# Altium project standos.PrjPcb
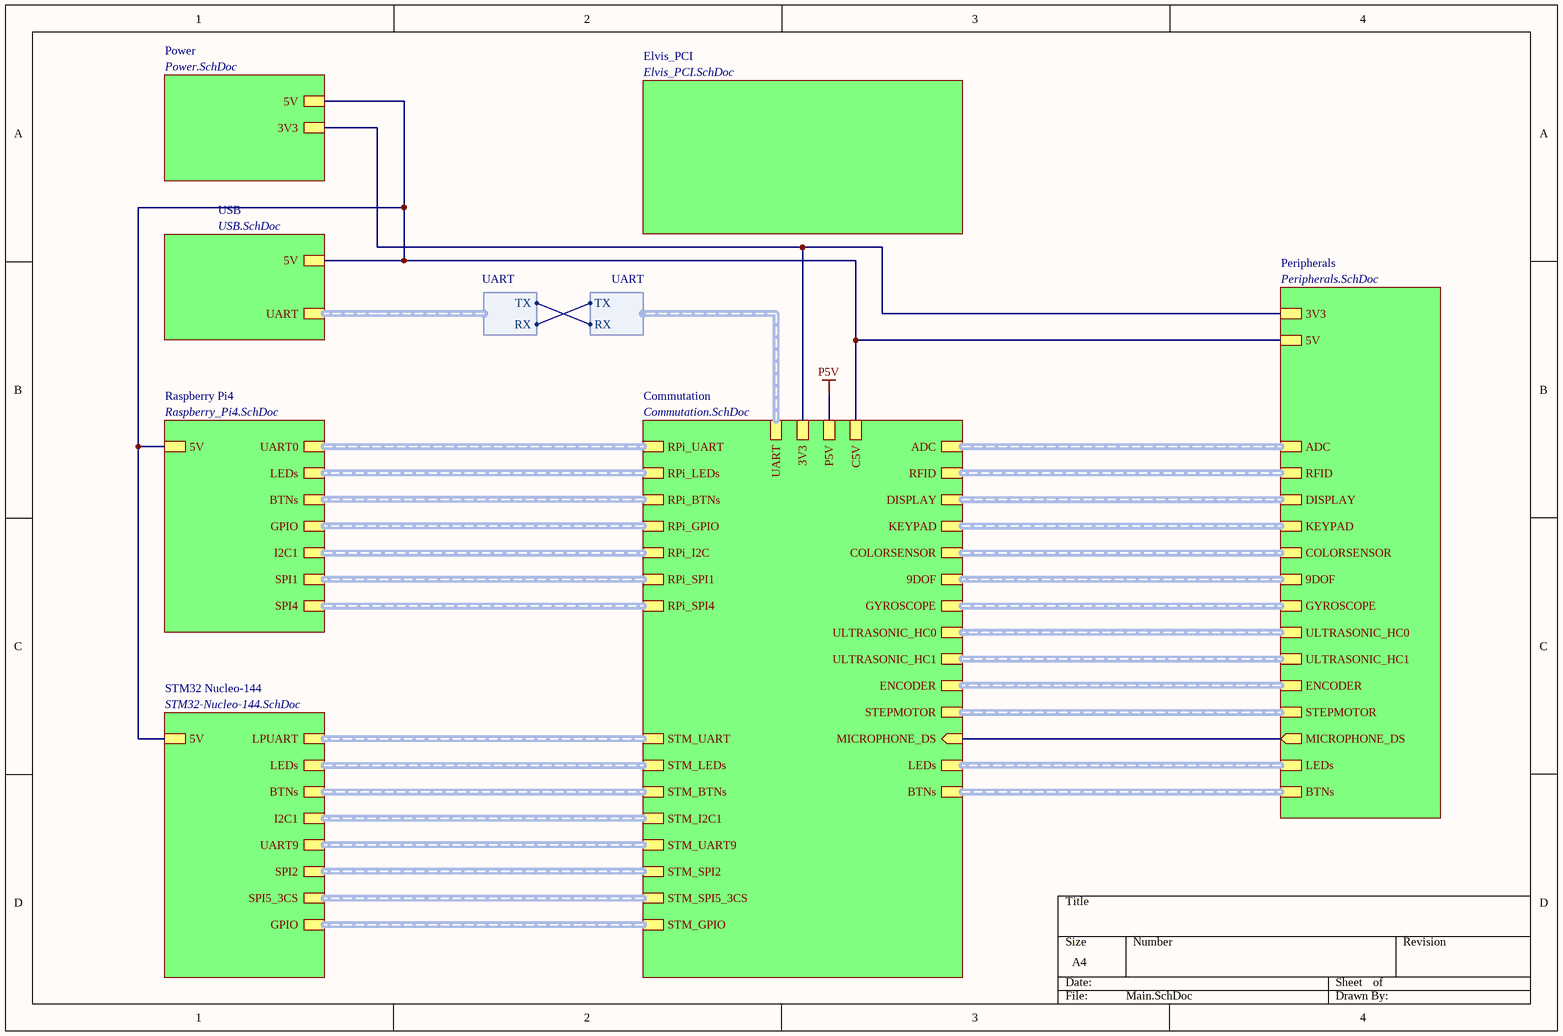
[diagram p0: Main.SchDoc]
11 sheets, 106 parts. Net scope: hierarchical (ports join the sheet entries above them; power ports are global).
Board files: standos.PcbDoc, standos_RPi_view.PcbDoc
Sheets:
  Main.SchDoc
    Power = Power.SchDoc
    Raspberry Pi4 = Raspberry_Pi4.SchDoc
    Elvis_PCI = Elvis_PCI.SchDoc
    Commutation = Commutation.SchDoc
    USB = USB.SchDoc
    Peripherals = Peripherals.SchDoc
      Inertial systems = Inertial_systems.SchDoc
      Rangefinders = Rangefinders.SchDoc
      Display = Display.SchDoc
    STM32 Nucleo-144 = STM32-Nucleo-144.SchDoc

## Sheet Main.SchDoc
size A4; SheetNumber: 1; SheetTotal: 11

### Sub-sheets
Commutation = Commutation.SchDoc: RPi_I2C (harness I2C), GYROSCOPE (harness GY-50 L3GD20 Gyro), STEPMOTOR (harness ULN2003 Module), DISPLAY (harness MSP3520), UART (harness UART), RPi_UART (harness UART), STM_UART (harness UART), MICROPHONE_DS (in), RPi_BTNs (harness BUTTONS), STM_BTNs (harness BUTTONS), BTNs (harness BUTTONS), RPi_LEDs (harness LEDS), LEDs (harness LEDS), STM_LEDs (harness LEDS), RPi_SPI4 (harness SPI_2CS), RPi_GPIO (harness RPi_GPIO), ADC (harness ADS1115 module), ULTRASONIC_HC0 (harness HC-SR04), ULTRASONIC_HC1 (harness HC-SR04), KEYPAD (harness Keypad COM-08653), RPi_SPI1 (harness SPI_3CS), RFID (harness RC522), STM_UART9 (harness UART), STM_SPI5_3CS (harness SPI_3CS), STM_I2C1 (harness I2C), STM_SPI2 (harness SPI), STM_GPIO (harness STM32_GPIO), 3V3, P5V, C5V, 9DOF (harness 9DOF), COLORSENSOR (harness TCS34725), ENCODER (harness KY-040)
Elvis_PCI = Elvis_PCI.SchDoc: no entries
Peripherals = Peripherals.SchDoc: 3V3, RFID (harness RC522), 5V, STEPMOTOR (harness ULN2003 Module), GYROSCOPE (harness GY-50 L3GD20 Gyro), MICROPHONE_DS (out), DISPLAY (harness MSP3520), BTNs (harness BUTTONS), ADC (harness ADS1115 module), LEDs (harness LEDS), ULTRASONIC_HC1 (harness HC-SR04), ULTRASONIC_HC0 (harness HC-SR04), KEYPAD (harness Keypad COM-08653), 9DOF (harness 9DOF), COLORSENSOR (harness TCS34725), ENCODER (harness KY-040)
Power = Power.SchDoc: 3V3, 5V
Raspberry Pi4 = Raspberry_Pi4.SchDoc: I2C1 (harness I2C), UART0 (harness UART), BTNs (harness BUTTONS), LEDs (harness LEDS), SPI4 (harness SPI_2CS), GPIO (harness RPI_GPIO), 5V, SPI1 (harness SPI_3CS)
STM32 Nucleo-144 = STM32-Nucleo-144.SchDoc: LEDs (harness LEDS), LPUART (harness UART), BTNs (harness BUTTONS), UART9 (harness UART), SPI2 (harness SPI), I2C1 (harness I2C), SPI5_3CS (harness SPI_3CS), GPIO (harness STM32_GPIO), 5V
USB = USB.SchDoc: UART (harness UART), 5V

### Harnesses
UART: TX, RX

### Nets
3V3: sheet Power/3V3, sheet Commutation/3V3, sheet Peripherals/3V3
C5V: sheet Power/5V, sheet Raspberry Pi4/5V, sheet Commutation/C5V, sheet USB/5V, sheet Peripherals/5V, sheet STM32 Nucleo-144/5V
MICROPHONE_DS: sheet Commutation/MICROPHONE_DS, sheet Peripherals/MICROPHONE_DS
RPi_GPIO14: sheet USB/UART.RX, sheet Raspberry Pi4/UART0.TX
RPi_GPIO15: sheet USB/UART.TX, sheet Raspberry Pi4/UART0.RX

### Buses and harness runs
harness sheet Commutation/9DOF = sheet Peripherals/9DOF
harness sheet Commutation/ADC = sheet Peripherals/ADC
harness sheet Commutation/BTNs = sheet Peripherals/BTNs
harness sheet Commutation/COLORSENSOR = sheet Peripherals/COLORSENSOR
harness sheet Commutation/DISPLAY = sheet Peripherals/DISPLAY
harness sheet Commutation/ENCODER = sheet Peripherals/ENCODER
harness sheet Commutation/GYROSCOPE = sheet Peripherals/GYROSCOPE
harness sheet Commutation/KEYPAD = sheet Peripherals/KEYPAD
harness sheet Commutation/LEDs = sheet Peripherals/LEDs
harness sheet Commutation/RFID = sheet Peripherals/RFID
harness sheet Commutation/RPi_BTNs = sheet Raspberry Pi4/BTNs
harness sheet Commutation/RPi_GPIO = sheet Raspberry Pi4/GPIO
harness sheet Commutation/RPi_I2C = sheet Raspberry Pi4/I2C1
harness sheet Commutation/RPi_LEDs = sheet Raspberry Pi4/LEDs
harness sheet Commutation/RPi_SPI1 = sheet Raspberry Pi4/SPI1
harness sheet Commutation/RPi_SPI4 = sheet Raspberry Pi4/SPI4
harness sheet Commutation/RPi_UART = sheet Raspberry Pi4/UART0
harness sheet Commutation/STEPMOTOR = sheet Peripherals/STEPMOTOR
harness sheet Commutation/STM_BTNs = sheet STM32 Nucleo-144/BTNs
harness sheet Commutation/STM_GPIO = sheet STM32 Nucleo-144/GPIO
harness sheet Commutation/STM_I2C1 = sheet STM32 Nucleo-144/I2C1
harness sheet Commutation/STM_LEDs = sheet STM32 Nucleo-144/LEDs
harness sheet Commutation/STM_SPI2 = sheet STM32 Nucleo-144/SPI2
harness sheet Commutation/STM_SPI5_3CS = sheet STM32 Nucleo-144/SPI5_3CS
harness sheet Commutation/STM_UART9 = sheet STM32 Nucleo-144/UART9
harness sheet Commutation/STM_UART = sheet STM32 Nucleo-144/LPUART
harness sheet Commutation/ULTRASONIC_HC0 = sheet Peripherals/ULTRASONIC_HC0
harness sheet Commutation/ULTRASONIC_HC1 = sheet Peripherals/ULTRASONIC_HC1

## Sheet Power.SchDoc
size A4; SheetNumber: 4; SheetTotal: 11
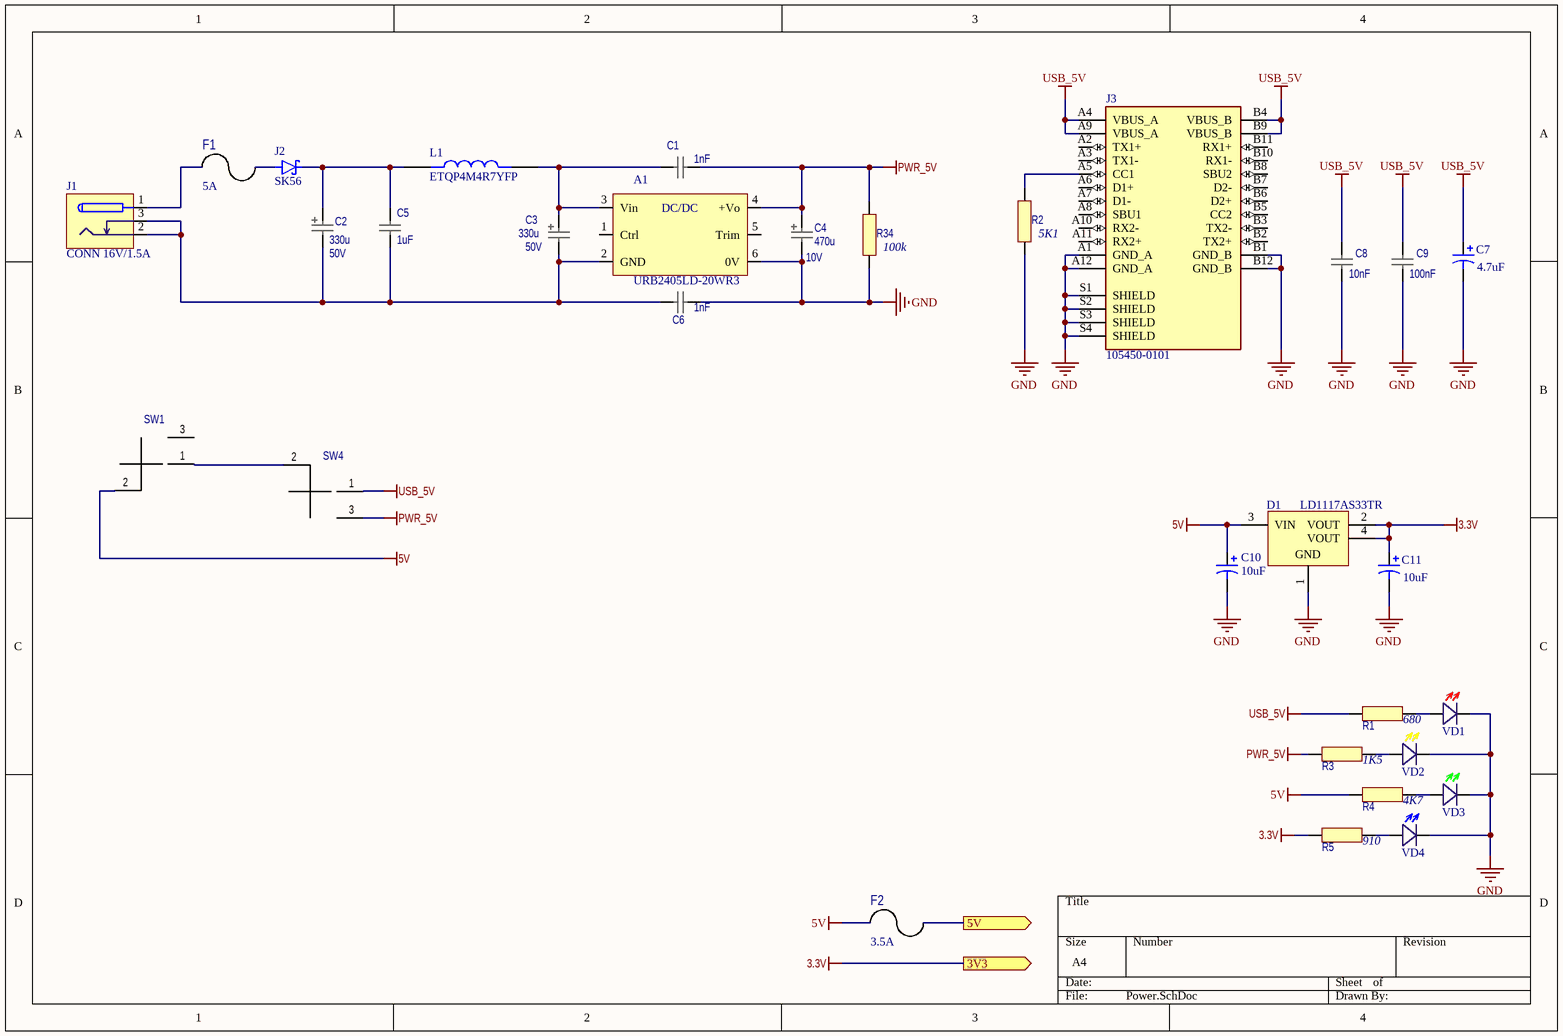
[diagram p1: Power.SchDoc]

### Parts
A1  URB2405LD-20WR3  [URB2405LD-20WR3]
C1  value 1nF  [C0805]  (hidden comment: C0805)
C2  value 330u  Voltage: 50V  [ECAP_10x17]  (hidden comment: C+)
C3  value 330u  Voltage: 50V  [ECAP_10x17]  (hidden comment: C+)
C4  value 470u  Voltage: 10V  [ECAP_8x12]  (hidden comment: C+)
C5  value 1uF  [C0805]  (hidden comment: C0805)
C6  value 1nF  [C0805]  (hidden comment: C0805)
C7  value 4.7uF  [D]  (hidden comment: 194D475X0015D2)
C8  value 10nF  [C0805]  (hidden comment: C0805)
C9  value 100nF  [C0805]  (hidden comment: C0805)
C10  value 10uF  [E]  (hidden comment: 194D106X0015E2)
C11  value 10uF  [3216]  (hidden comment: 293D106X0004A2)
D1  LD1117AS33TR  [SOT-223_N]
F1  5A  [FUSC6127X269N]
F2  3.5A  [FUSC6127X269N]
J1  CONN 16V/1.5A  [DS-261]
J2  SK56  [SMC]
J3  105450-0101  [MOLEX_105450-0101]
L1  ETQP4M4R7YFP  [L]
R1  value 680  [R0805]  (hidden comment: R0805)
R2  value 5K1  [R0805]  (hidden comment: R0805)
R3  value 1K5  [R0805]  (hidden comment: R0805)
R4  value 4K7  [R0805]  (hidden comment: R0805)
R5  value 910  [R0805]  (hidden comment: R0805)
R34  value 100k  [R0805]  (hidden comment: R0805)
SW1  KLS7-SS03-12D02-EG-3.0  [SL19123]  (value not drawn)
SW4  KLS7-SS03-12D02-EG-3.0  [switch]  (value not drawn)
VD1  TO-1608BC-MRE  [TO-1608BC-MRE]  (value not drawn)
VD2  TO-1608BC-MYF  [TO-1608BC-MYF]  (value not drawn)
VD3  TO-1608BC-PG  [TO-1608BC-PG]  (value not drawn)
VD4  TO-1608BC-BF  [TO-1608BC-BF]  (value not drawn)

### Ports
3V3 (out), 5V (out)

### Nets
3.3V: C11.1 D1.2(VOUT) D1.4(VOUT) R5.2 ; port 3V3  [project net 3V3]
5V: C10.1 D1.3(VIN) F2.1 R4.2 SW1.2
GND: A1.6(0V) C4.2 C6.1 C7.2 C8.1 C9.1 C10.2 C11.2 D1.1(GND) J3.A1(GND_A) J3.A12(GND_A) J3.B1(GND_B) J3.B12(GND_B) J3.S1(SHIELD) J3.S2(SHIELD) J3.S3(SHIELD) J3.S4(SHIELD) R2.2 R34.2 VD1.- VD2.- VD3.- VD4.-
PWR_5V: A1.4(+Vo) C1.1 C4.1 R3.2 R34.1 SW4.3
USB_5V: C7.1 C8.2 C9.2 F2.2 J3.A4(VBUS_A) J3.A9(VBUS_A) J3.B4(VBUS_B) J3.B9(VBUS_B) R1.2 SW4.1 ; port 5V  [project net C5V]
NetA1_2: A1.2(GND) C2.2 C3.2 C5.1 C6.2 J1.2 J1.3
NetA1_3: A1.3(Vin) C1.2 C3.1 L1.2
NetC2_1: C2.1 C5.2 J2.2(C) L1.1
NetF1_1: F1.1 J1.1
NetF1_2: F1.2 J2.1(A)
NetJ3_A5: J3.A5(CC1) R2.1
NetR1_1: R1.1 VD1.+
NetR3_1: R3.1 VD2.+
NetR4_1: R4.1 VD3.+
NetR5_1: R5.1 VD4.+
NetSW1_1: SW1.1 SW4.2

Not connected (* = marked no-connect by the designer): A1 1(Ctrl) 5(Trim); J3 A2(TX1+) A3(TX1-) A6(D1+) A7(D1-) A8(SBU1) A10(RX2-) A11(RX2+) B2(TX2+) B3(TX2-) B5(CC2) B6(D2+) B7(D2-) B8(SBU2) B10(RX1-) B11(RX1+); SW1 3

### Notes on the sheet
- (in symbol URB2405LD-20WR3) DC/DC

### Library data of the parts
C1 C5 C6 C8 C9 = C0805: Tolerance: %; Voltage: B; Case: *; Dielectric: *; Mount: *; PartNumber: *
C2-C4 = C+: Tolerance: %; Case: *; Dielectric: *; Mount: *; PartNumber: *
C7 = 194D475X0015D2: Midget Conformal Coated Solid Tantalum Chip Capacitor: 4.7uF, 20% Tolerance, 15 WVDC @ +85°C, Surge = 20V; Note: See Data Sheet for full range of components; Published: 19-Mar-2004; PackageReference: D; Publisher: Altium Limited; DatasheetDocument: 05-Jul-2002; ComponentLink1Description: Manufacturer Link; ComponentLink1URL: http://www.vishay.com/; ComponentLink2Description: Datasheet; ComponentLink2URL: http://www.vishay.com/docs/40000/194d.pdf
C10 = 194D106X0015E2: Midget Conformal Coated Solid Tantalum Chip Capacitor: 10uF, 20% Tolerance, 15 WVDC @ +85°C, Surge = 20V; Note: See Data Sheet for full range of components; Published: 19-Mar-2004; DatasheetDocument: 05-Jul-2002; PackageReference: E; Publisher: Altium Limited; ComponentLink1Description: Manufacturer Link; ComponentLink1URL: http://www.vishay.com/; ComponentLink2Description: Datasheet; ComponentLink2URL: http://www.vishay.com/docs/40000/194d.pdf
C11 = 293D106X0004A2: Tantamount Commercial, Surface Mount Solid Tantalum Chip Capacitor: 10uF, 20% Tolerance, 4 WVDC @ +85°C, Surge = 5.2V; Note: See Data Sheet for full range of components; Published: 19-Mar-2004; DatasheetDocument: 05-Feb-2003; PackageReference: 3216; Publisher: Altium Limited; Code_JEITA: 3216; ComponentLink1Description: Manufacturer Link; ComponentLink1URL: http://www.vishay.com/; ComponentLink2Description: Datasheet; ComponentLink2URL: http://www.vishay.com/docs/40002/293d.pdf
D1 = LD1117AS33TR: 1A, Low Drop Positive Voltage Regulator, 3.3V, 4-Pin SOT-223, Tape and Reel; PartNumber: LD1117AS33TR; DatasheetVersion: Dec-2011; PackageVersion: 2010; PackageReference: SOT-223; PackageDescription: 4-Pin SOT-223 Package, 6.5 x 3.5 mm Body, 2.3 mm Pitch, 7 mm Lead Span; ComponentLink1Description: Manufacturer URL; ComponentLink1URL: http://www.st.com; ComponentLink2Description: Datasheet; ComponentLink2URL: http://www.st.com/internet/com/TECHNICAL_RESOURCES/TECHNICAL_LITERATURE/DATASHEET/CD00002116.pdf
F1 F2 = F: 045303.5MR
J1 = DS-261
J2 = SK56: Diode Schottky 60V 5A Surface Mount SMC (DO-214AB); MF: Diotec Semiconductor; SnapEDA_Link: https://www.snapeda.com/parts/SK56/Diotec/view-part/5719358/?ref=snap; Package: DO-214AB-214 Diotec Semiconductor; Check_prices: https://www.snapeda.com/parts/SK56/Diotec/view-part/5719358/?ref=eda; Availability: In Stock; Price: None; MP: SK56; Value: *
L1 = ETQP4M4R7YFP: Power Choke Shielded Wirewound 4.7uH 20% 100KHz Metal 4.8A 39.6mOhm DCR Automotive T/R; MF: Panasonic; Value: *; Price: None; Package: SMD-2 Panasonic; Check_prices: https://www.snapeda.com/parts/ETQP4M4R7YFP/Panasonic/view-part/1533841/?ref=eda; Availability: In Stock; SnapEDA_Link: https://www.snapeda.com/parts/ETQP4M4R7YFP/Panasonic/view-part/1533841/?ref=snap; MP: ETQP4M4R7YFP; Purchase-URL: https://pricing.snapeda.com/search/part/ETQP4M4R7YFP/?ref=eda
SW1 = SL19123 (switch)
SW4 = SW
VD1 = TO-1608BC-MRE: LED SMD 1608 112мКд, 120°, 630нМ (Ultra Bright Red)
VD2 = TO-1608BC-MYF: LED SMD 1608 247мКд, 120°, 592нМ (High Bright Yellow)
VD3 = TO-1608BC-PG: LED SMD 1608 705мКд, 120°, 525нМ (Pure Green)
VD4 = TO-1608BC-BF: LED SMD 1608 247мКд, 120°, 468нМ (Blue)
J3 = 105450-0101: Package: None; Availability: Unavailable; Value: *; MP: 105450-0101; Price: None
R1-R5 R34 = R0805: Case: *; Mount: *; PartNumber: *; Power: *; Tolerance: *

## Sheet Raspberry_Pi4.SchDoc
size 381 x 241 mm; SheetNumber: 3; SheetTotal: 11
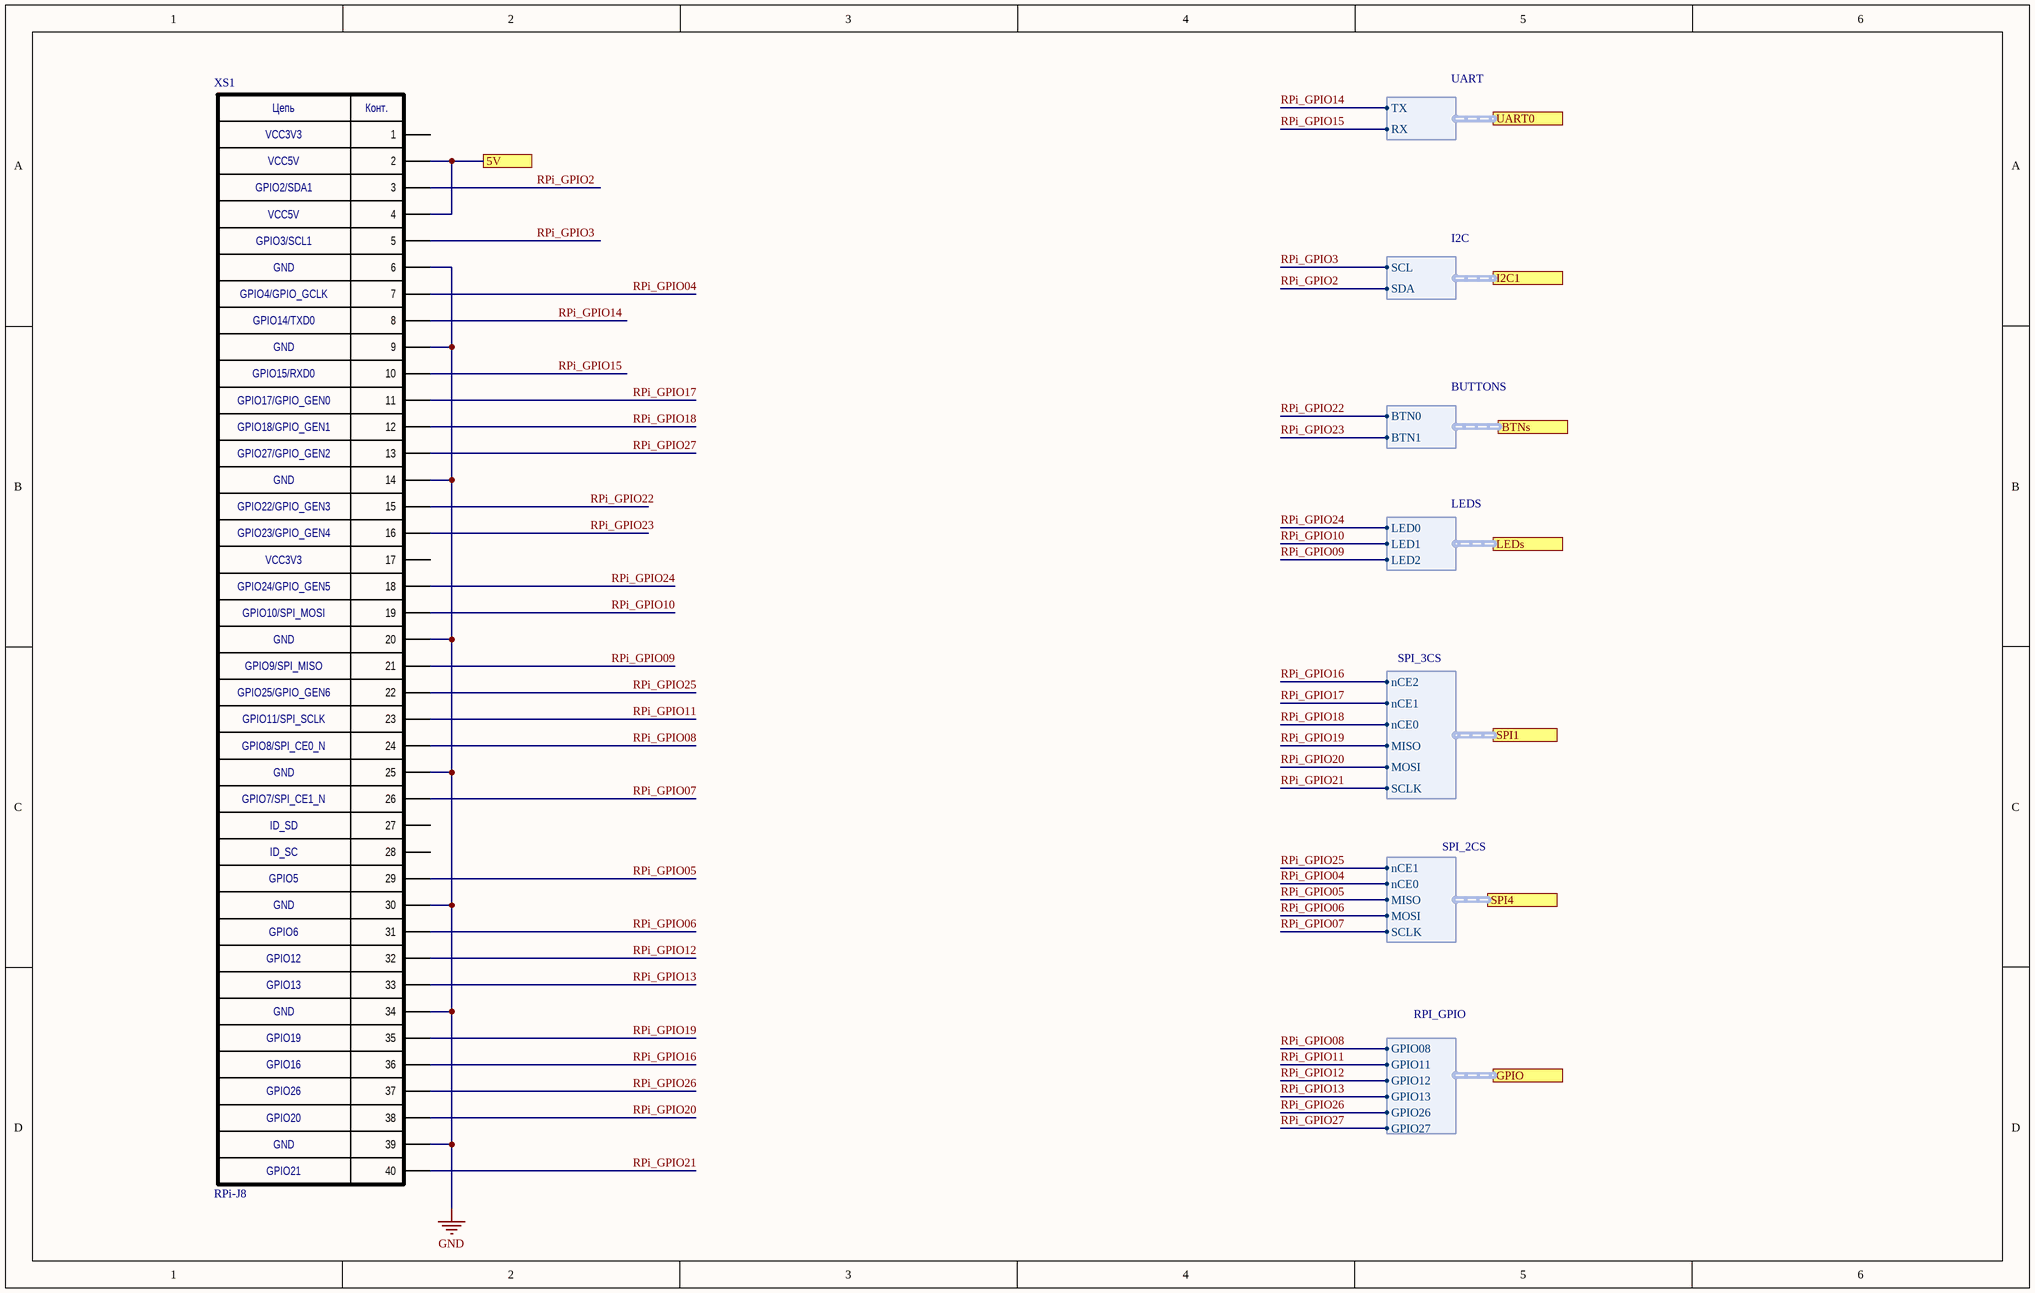
[diagram p2: Raspberry_Pi4.SchDoc]

### Parts
XS1  RPi-J8  40: GPIO21  39: GND  38: GPIO20  37: GPIO26  36: GPIO16  35: GPIO19  33: GPIO13  32: GPIO12  31: GPIO6  29: GPIO5  28: ID_SC  27: ID_SD  26: GPIO7/SPI_CE1_N  24: GPIO8/SPI_CE0_N  23: GPIO11/SPI_SCLK  22: GPIO25/GPIO_GEN6  21: GPIO9/SPI_MISO  19: GPIO10/SPI_MOSI  18: GPIO24/GPIO_GEN5  17: VCC3V3  16: GPIO23/GPIO_GEN4  15: GPIO22/GPIO_GEN3  13: GPIO27/GPIO_GEN2  8: GPIO14/TXD0  7: GPIO4/GPIO_GCLK  12: GPIO18/GPIO_GEN1  5: GPIO3/SCL1  4: VCC5V  3: GPIO2/SDA1  11: GPIO17/GPIO_GEN0  10: GPIO15/RXD0  [RaPi_PLD-40]

### Ports
5V, BTNs (harness BUTTONS), GPIO (harness RPI_GPIO), I2C1 (harness I2C), LEDs (harness LEDS), SPI1 (harness SPI_3CS), SPI4 (harness SPI_2CS), UART0 (harness UART)

### Harnesses
UART: TX, RX
I2C: SCL, SDA
RPI_GPIO: GPIO08, GPIO11, GPIO26, GPIO27, GPIO12, GPIO13
BUTTONS: BTN0, BTN1
LEDS: LED0, LED1, LED2
SPI_2CS: nCE1, nCE0, MISO, MOSI, SCLK
SPI_3CS: MISO, MOSI, nCE0, nCE1, nCE2, SCLK

### Nets
C5V: XS1.2 XS1.4 ; port 5V
GND: XS1.6 XS1.9 XS1.14 XS1.20 XS1.25 XS1.30 XS1.34 XS1.39
RPi_GPIO2: XS1.3 ; port I2C1.SDA  [project net 9DOF.I2C.SDA]
RPi_GPIO3: XS1.5 ; port I2C1.SCL  [project net 9DOF.I2C.SCL]
RPi_GPIO04: XS1.7 ; port SPI4.nCE0
RPi_GPIO05: XS1.29 ; port SPI4.MISO
RPi_GPIO06: XS1.31 ; port SPI4.MOSI
RPi_GPIO07: XS1.26 ; port SPI4.SCLK
RPi_GPIO08: XS1.24 ; port GPIO.GPIO08  [project net RPi_GPIO.GPIO08]
RPi_GPIO09: XS1.21 ; port LEDs.LED2  [project net LED2]
RPi_GPIO10: XS1.19 ; port LEDs.LED1  [project net LED1]
RPi_GPIO11: XS1.23 ; port GPIO.GPIO11  [project net RPi_GPIO.GPIO11]
RPi_GPIO12: XS1.32 ; port GPIO.GPIO12  [project net RPi_GPIO.GPIO12]
RPi_GPIO13: XS1.33 ; port GPIO.GPIO13  [project net RPi_GPIO.GPIO13]
RPi_GPIO14: XS1.8 ; port UART0.TX
RPi_GPIO15: XS1.10 ; port UART0.RX
RPi_GPIO16: XS1.36 ; port SPI1.nCE2
RPi_GPIO17: XS1.11 ; port SPI1.nCE1
RPi_GPIO18: XS1.12 ; port SPI1.nCE0
RPi_GPIO19: XS1.35 ; port SPI1.MISO
RPi_GPIO20: XS1.38 ; port SPI1.MOSI
RPi_GPIO21: XS1.40 ; port SPI1.SCLK
RPi_GPIO22: XS1.15 ; port BTNs.BTN0  [project net BTN0]
RPi_GPIO23: XS1.16 ; port BTNs.BTN1  [project net BTN1]
RPi_GPIO24: XS1.18 ; port LEDs.LED0  [project net LED0]
RPi_GPIO25: XS1.22 ; port SPI4.nCE1
RPi_GPIO26: XS1.37 ; port GPIO.GPIO26  [project net RPi_GPIO.GPIO26]
RPi_GPIO27: XS1.13 ; port GPIO.GPIO27  [project net RPi_GPIO.GPIO27]

Not connected (* = marked no-connect by the designer): XS1 1 17 27 28

### Notes on the sheet
- (in symbol RPi-J8) Цепь; Конт.

### Library data of the parts
XS1 = RPi-J8: 34: GND; 30: GND; 25: GND; 20: GND; 14: GND; 9: GND; 2: VCC5V; 6: GND; 1: VCC3V3

## Sheet Elvis_PCI.SchDoc
size A4; SheetNumber: 2; SheetTotal: 11
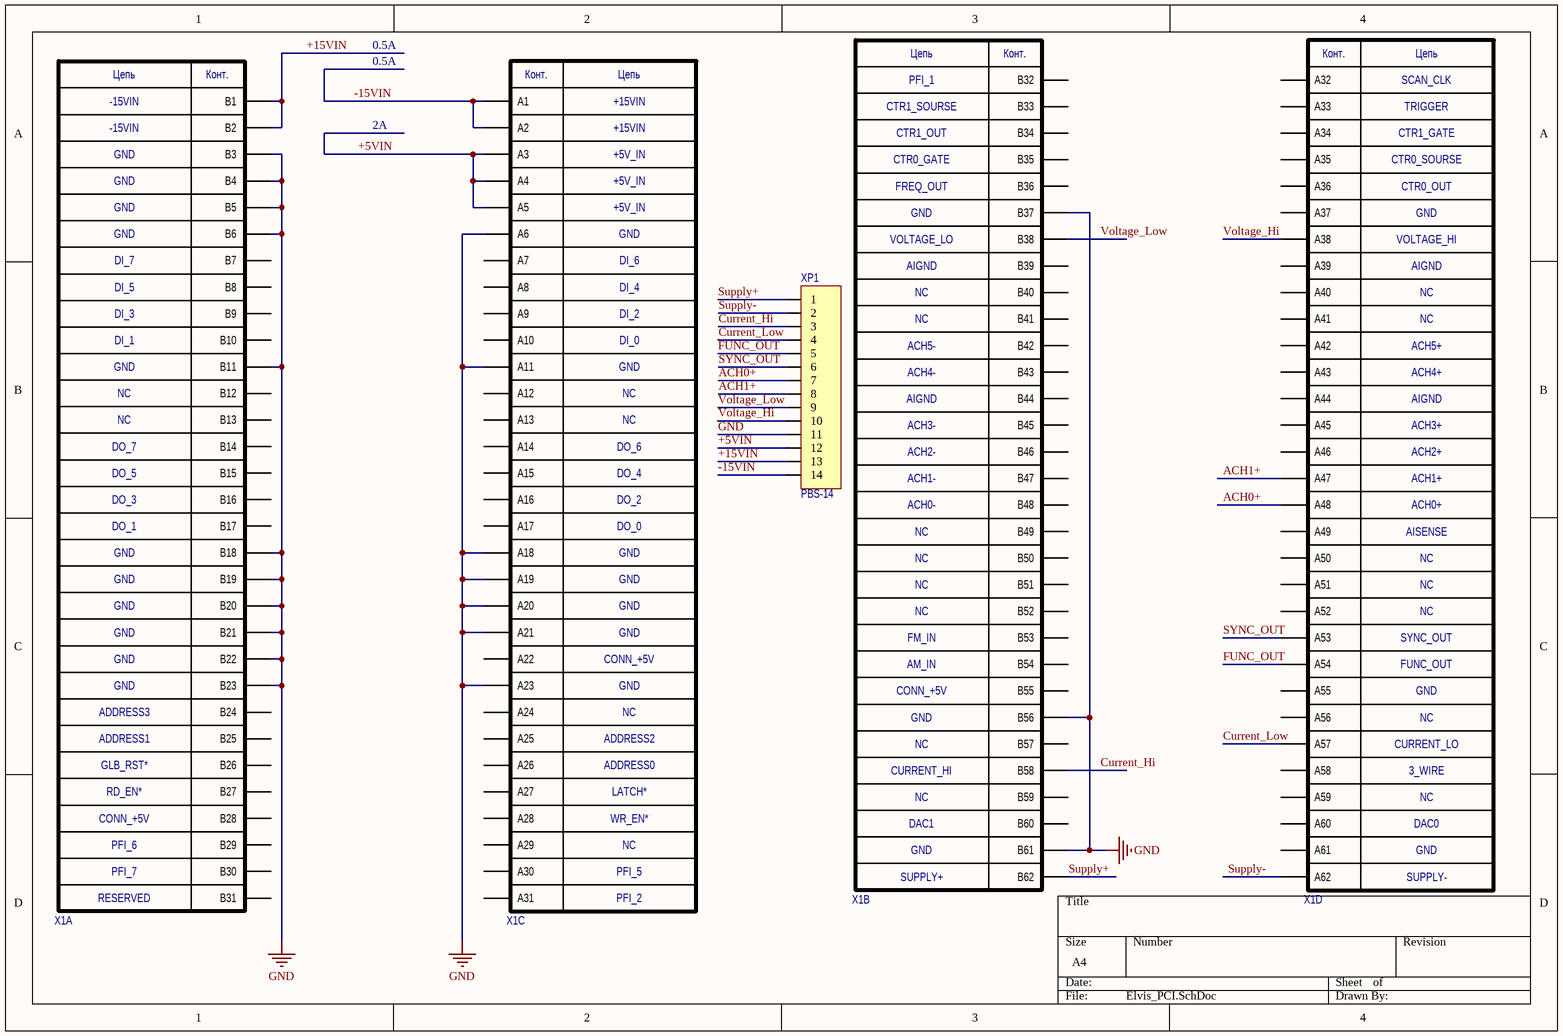
[diagram p3: Elvis_PCI.SchDoc]

### Parts
X1  PCI  [PCI]  (value not drawn)  (parts A,B,C,D of 4)
XP1  PBS-14  [PBS-14]

### Nets
GND: X1.A6 X1.A11 X1.A18 X1.A19 X1.A20 X1.A21 X1.A23 X1.B3 X1.B4 X1.B5 X1.B6 X1.B11 X1.B18 X1.B19 X1.B20 X1.B21 X1.B22 X1.B23 X1.B37 X1.B56 X1.B61 XP1.11
+5VIN: X1.A3 X1.A4 X1.A5 XP1.12
+15VIN: X1.B1 X1.B2 XP1.13
-15VIN: X1.A1 X1.A2 XP1.14
ACH0+: X1.A48 XP1.7
ACH1+: X1.A47 XP1.8
Current_Hi: X1.B58 XP1.3
Current_Low: X1.A57 XP1.4
FUNC_OUT: X1.A54 XP1.5
Supply+: X1.B62 XP1.1
Supply-: X1.A62 XP1.2
SYNC_OUT: X1.A53 XP1.6
Voltage_Hi: X1.A38 XP1.10
Voltage_Low: X1.B38 XP1.9

Not connected (* = marked no-connect by the designer): X1 A7 A8 A9 A10 A12 A13 A14 A15 A16 A17 A22 A24 A25 A26 A27 A28 A29 A30 A31 A32 A33 A34 A35 A36 A37 A39 A40 A41 A42 A43 A44 A45 A46 A49 A50 A51 A52 A55 A56 A58 A59 A60 A61 B7 B8 B9 B10 B12 B13 B14 B15 B16 B17 B24 B25 B26 B27 B28 B29 B30 B31 B32 B33 B34 B35 B36 B39 B40 B41 B42 B43 B44 B45 B46 B47 B48 B49 B50 B51 B52 B53 B54 B55 B57 B59 B60

### Notes on the sheet
- 0.5A
- 2A
- (in symbol PCI, part A) Цепь; Конт.; -15VIN; GND; DI_7; DI_5; DI_3; DI_1; NC; DO_7; DO_5; DO_3; DO_1; ADDRESS3; ADDRESS1; GLB_RST*; RD_EN*; CONN_+5V; PFI_6; PFI_7; RESERVED
- (in symbol PCI, part B) Цепь; Конт.; PFI_1; CTR1_SOURSE; CTR1_OUT; CTR0_GATE; FREQ_OUT; GND; VOLTAGE_LO; AIGND; NC; ACH5-; ACH4-; ACH3-; ACH2-; ACH1-; ACH0-; FM_IN; AM_IN; CONN_+5V; CURRENT_HI; DAC1; SUPPLY+
- (in symbol PCI, part C) Конт.; Цепь; +15VIN; +5V_IN; GND; DI_6; DI_4; DI_2; DI_0; NC; DO_6; DO_4; DO_2; DO_0; CONN_+5V; ADDRESS2; ADDRESS0; LATCH*; WR_EN*; PFI_5; PFI_2
- (in symbol PCI, part D) Конт.; Цепь; SCAN_CLK; TRIGGER; CTR1_GATE; CTR0_SOURSE; CTR0_OUT; GND; VOLTAGE_HI; AIGND; NC; ACH5+; ACH4+; ACH3+; ACH2+; ACH1+; ACH0+; AISENSE; SYNC_OUT; FUNC_OUT; CURRENT_LO; 3_WIRE; DAC0; SUPPLY-

## Sheet Commutation.SchDoc
size A3; SheetNumber: 5; SheetTotal: 11
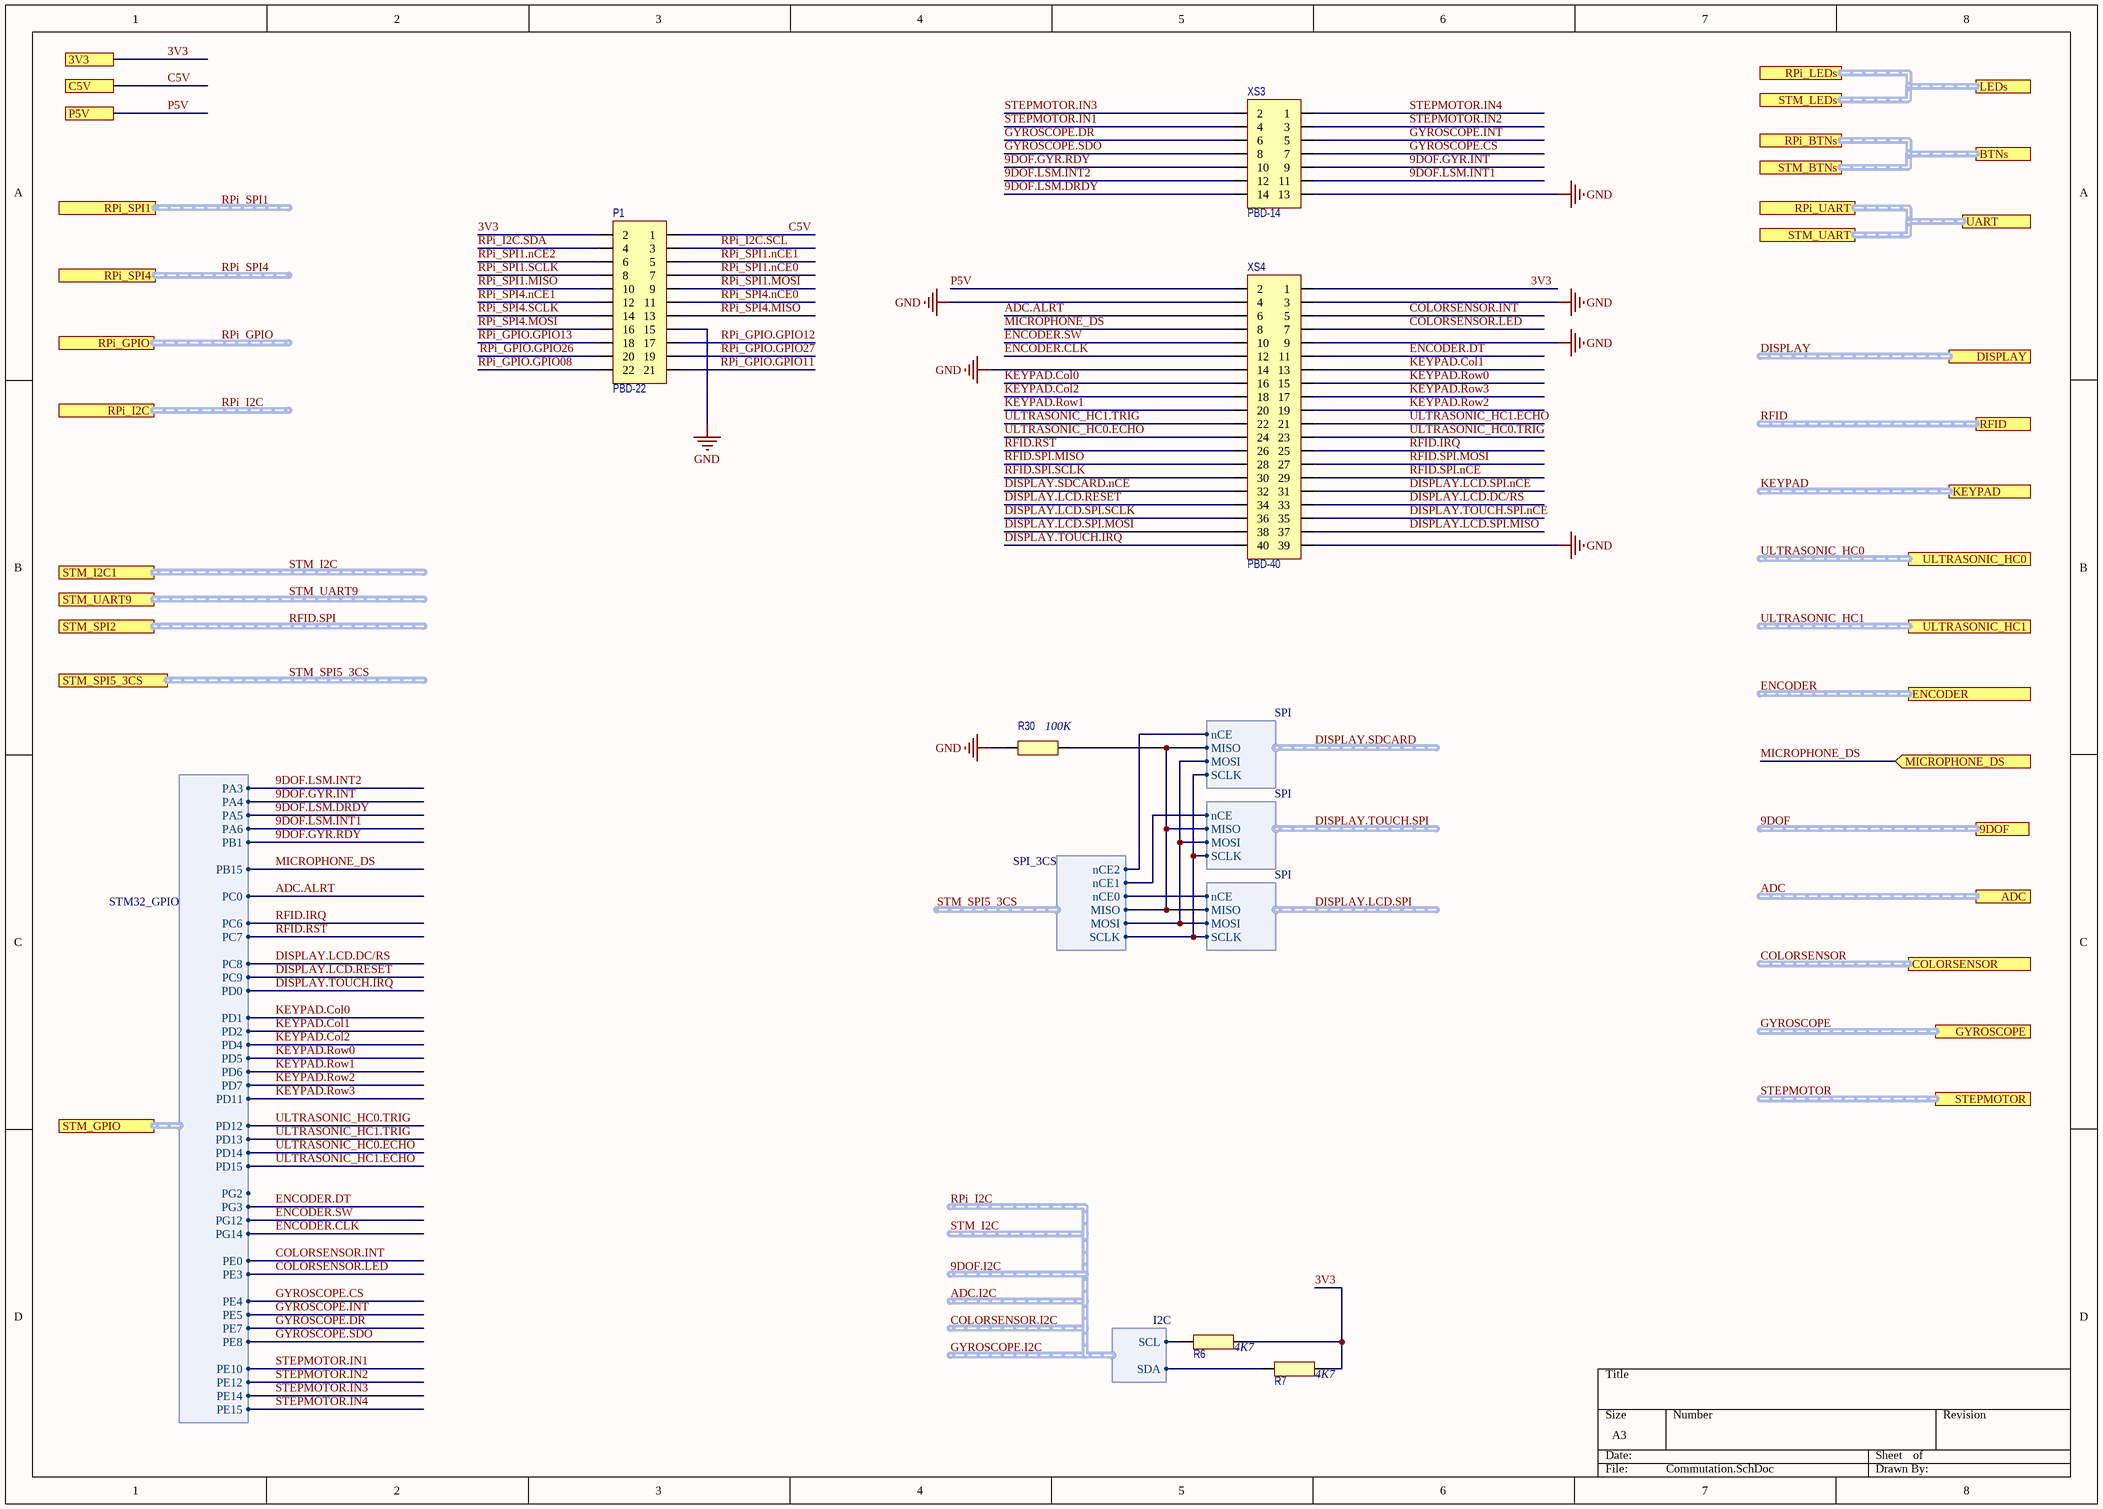
[diagram p4: Commutation.SchDoc]

### Parts
P1  PBD-22  [PBD-22]
R6  value 4K7  [R0805]  (hidden comment: R0805)
R7  value 4K7  [R0805]  (hidden comment: R0805)
R30  value 100K  [R0805]  (hidden comment: R0805)
XS3  PBD-14  [PBD-14]
XS4  PBD-40  [PBD-40]

### Ports
3V3, 9DOF (harness 9DOF), ADC (harness ADS1115 module), BTNs (harness BUTTONS), C5V, COLORSENSOR (harness TCS34725), DISPLAY (harness MSP3520), ENCODER (harness KY-040), GYROSCOPE (harness GY-50 L3GD20 Gyro), KEYPAD (harness Keypad COM-08653), LEDs (harness LEDS), MICROPHONE_DS (in), P5V, RFID (harness RC522), RPi_BTNs (harness BUTTONS), RPi_GPIO (harness RPi_GPIO), RPi_I2C (harness I2C), RPi_LEDs (harness LEDS), RPi_SPI1 (harness SPI_3CS), RPi_SPI4 (harness SPI_2CS), RPi_UART (harness UART), STEPMOTOR (harness ULN2003 Module), STM_BTNs (harness BUTTONS), STM_GPIO (harness STM32_GPIO), STM_I2C1 (harness I2C), STM_LEDs (harness LEDS), STM_SPI2 (harness SPI), STM_SPI5_3CS (harness SPI_3CS), STM_UART9 (harness UART), STM_UART (harness UART), UART (harness UART), ULTRASONIC_HC0 (harness HC-SR04), ULTRASONIC_HC1 (harness HC-SR04)

### Harnesses
I2C: SCL, SDA
SPI: nCE, MISO, MOSI, SCLK
STM32_GPIO: PB1, PB15, PC0, PC6, PC7, PC8, PC9, PD0, PD1, PD2, PD4, PD5, PD6, PD11, PD12, PD13, PD14, PD15, PG2, PG3, PG12, PG14, PE0, PE3, PE4, PE5, PE7, PE8, PE10, PE12, PE14, PE15, PD7, PA6, PA3, PA4, PA5
SPI_3CS: nCE2, nCE1, nCE0, MISO, MOSI, SCLK

### Nets
3V3: P1.2 R6.1 R7.1 XS4.1 ; port 3V3
C5V: P1.1 ; port C5V
GND: P1.15 R30.1 XS3.13 XS4.3 XS4.4 XS4.9 XS4.14 XS4.39
P5V: XS4.2 ; port P5V
9DOF.GYR.INT: XS3.9 ; port STM_GPIO.PA4
9DOF.GYR.RDY: XS3.10 ; port STM_GPIO.PB1
9DOF.I2C.SCL: R6.2 ; port RPi_I2C.SCL
9DOF.I2C.SDA: R7.2 ; port RPi_I2C.SDA
9DOF.LSM.DRDY: XS3.14 ; port STM_GPIO.PA5
9DOF.LSM.INT1: XS3.11 ; port STM_GPIO.PA6
9DOF.LSM.INT2: XS3.12 ; port STM_GPIO.PA3
ADC.ALRT: XS4.6 ; port STM_GPIO.PC0
COLORSENSOR.INT: XS4.5 ; port STM_GPIO.PE0
COLORSENSOR.LED: XS4.7 ; port STM_GPIO.PE3
DISPLAY.LCD.DC/RS: XS4.33 ; port STM_GPIO.PC8
DISPLAY.LCD.RESET: XS4.34 ; port STM_GPIO.PC9
DISPLAY.LCD.SPI.MISO: R30.2 ; harness SPI.MISO, port STM_SPI5_3CS.MISO
DISPLAY.LCD.SPI.MISO: XS4.37  [a separate net that carries the same name]
DISPLAY.LCD.SPI.MOSI: XS4.38
DISPLAY.LCD.SPI.MOSI: harness SPI.MOSI, port STM_SPI5_3CS.MOSI  [a separate net that carries the same name]
DISPLAY.LCD.SPI.nCE: XS4.31
DISPLAY.LCD.SPI.nCE: harness SPI.nCE, port STM_SPI5_3CS.nCE0  [a separate net that carries the same name]
DISPLAY.LCD.SPI.SCLK: XS4.36
DISPLAY.LCD.SPI.SCLK: harness SPI.SCLK, port STM_SPI5_3CS.SCLK  [a separate net that carries the same name]
DISPLAY.SDCARD.nCE: XS4.32
DISPLAY.SDCARD.nCE: harness SPI.nCE, port STM_SPI5_3CS.nCE2  [a separate net that carries the same name]
DISPLAY.TOUCH.IRQ: XS4.40 ; port STM_GPIO.PD0
DISPLAY.TOUCH.SPI.nCE: XS4.35
DISPLAY.TOUCH.SPI.nCE: harness SPI.nCE, port STM_SPI5_3CS.nCE1  [a separate net that carries the same name]
ENCODER.CLK: XS4.12 ; port STM_GPIO.PG14
ENCODER.DT: XS4.11 ; port STM_GPIO.PG3
ENCODER.SW: XS4.10 ; port STM_GPIO.PG12
GYROSCOPE.CS: XS3.7 ; port STM_GPIO.PE4
GYROSCOPE.DR: XS3.6 ; port STM_GPIO.PE7
GYROSCOPE.INT: XS3.5 ; port STM_GPIO.PE5
GYROSCOPE.SDO: XS3.8 ; port STM_GPIO.PE8
KEYPAD.Col0: XS4.16 ; port STM_GPIO.PD1
KEYPAD.Col1: XS4.13 ; port STM_GPIO.PD2
KEYPAD.Col2: XS4.18 ; port STM_GPIO.PD4
KEYPAD.Row0: XS4.15 ; port STM_GPIO.PD5
KEYPAD.Row1: XS4.20 ; port STM_GPIO.PD6
KEYPAD.Row2: XS4.19 ; port STM_GPIO.PD7
KEYPAD.Row3: XS4.17 ; port STM_GPIO.PD11
MICROPHONE_DS: XS4.8 ; port MICROPHONE_DS, port STM_GPIO.PB15
RFID.IRQ: XS4.25 ; port STM_GPIO.PC6
RFID.RST: XS4.26 ; port STM_GPIO.PC7
RFID.SPI.MISO: XS4.28
RFID.SPI.MOSI: XS4.27
RFID.SPI.nCE: XS4.29
RFID.SPI.SCLK: XS4.30
RPi_GPIO.GPIO08: P1.22
RPi_GPIO.GPIO11: P1.21
RPi_GPIO.GPIO12: P1.17
RPi_GPIO.GPIO13: P1.18
RPi_GPIO.GPIO26: P1.20
RPi_GPIO.GPIO27: P1.19
RPi_I2C.SCL: P1.3
RPi_I2C.SDA: P1.4
RPi_SPI1.MISO: P1.10
RPi_SPI1.MOSI: P1.9
RPi_SPI1.nCE0: P1.7
RPi_SPI1.nCE1: P1.5
RPi_SPI1.nCE2: P1.6
RPi_SPI1.SCLK: P1.8
RPi_SPI4.MISO: P1.13
RPi_SPI4.MOSI: P1.16
RPi_SPI4.nCE0: P1.11
RPi_SPI4.nCE1: P1.12
RPi_SPI4.SCLK: P1.14
STEPMOTOR.IN1: XS3.4 ; port STM_GPIO.PE10
STEPMOTOR.IN2: XS3.3 ; port STM_GPIO.PE12
STEPMOTOR.IN3: XS3.2 ; port STM_GPIO.PE14
STEPMOTOR.IN4: XS3.1 ; port STM_GPIO.PE15
ULTRASONIC_HC0.ECHO: XS4.24 ; port STM_GPIO.PD14  [project net STM_PD14]
ULTRASONIC_HC0.TRIG: XS4.23 ; port STM_GPIO.PD12  [project net STM_PD12]
ULTRASONIC_HC1.ECHO: XS4.21 ; port STM_GPIO.PD15  [project net STM_PD15]
ULTRASONIC_HC1.TRIG: XS4.22 ; port STM_GPIO.PD13  [project net STM_PD13]

### Buses and harness runs
harness 9DOF = port 9DOF
harness 9DOF.I2C = ADC.I2C = COLORSENSOR.I2C = GYROSCOPE.I2C = RPi_I2C = STM_I2C
harness ADC = port ADC
harness COLORSENSOR = port COLORSENSOR
harness DISPLAY = port DISPLAY
harness ENCODER = port ENCODER
harness GYROSCOPE = port GYROSCOPE
harness KEYPAD = port KEYPAD
harness port BTNs = port RPi_BTNs = port STM_BTNs
harness port LEDs = port RPi_LEDs = port STM_LEDs
harness port RPi_UART = port STM_UART = port UART
harness RFID = port RFID
harness RFID.SPI = port STM_SPI2
harness RPi_GPIO = port RPi_GPIO
harness RPi_I2C = port RPi_I2C
harness RPi_SPI1 = port RPi_SPI1
harness RPi_SPI4 = port RPi_SPI4
harness STEPMOTOR = port STEPMOTOR
harness STM_I2C = port STM_I2C1
harness STM_SPI5_3CS = port STM_SPI5_3CS
harness STM_UART9 = port STM_UART9
harness ULTRASONIC_HC0 = port ULTRASONIC_HC0
harness ULTRASONIC_HC1 = port ULTRASONIC_HC1

### Library data of the parts
R6 R7 R30 = R0805: Case: *; Mount: *; PartNumber: *; Power: *; Tolerance: *

## Sheet USB.SchDoc
size A4; SheetNumber: 6; SheetTotal: 11; SPICEModelCacheVCEAXSSD: <root> / <DocumentId>VCEAXSSD</DocumentId> / </root>
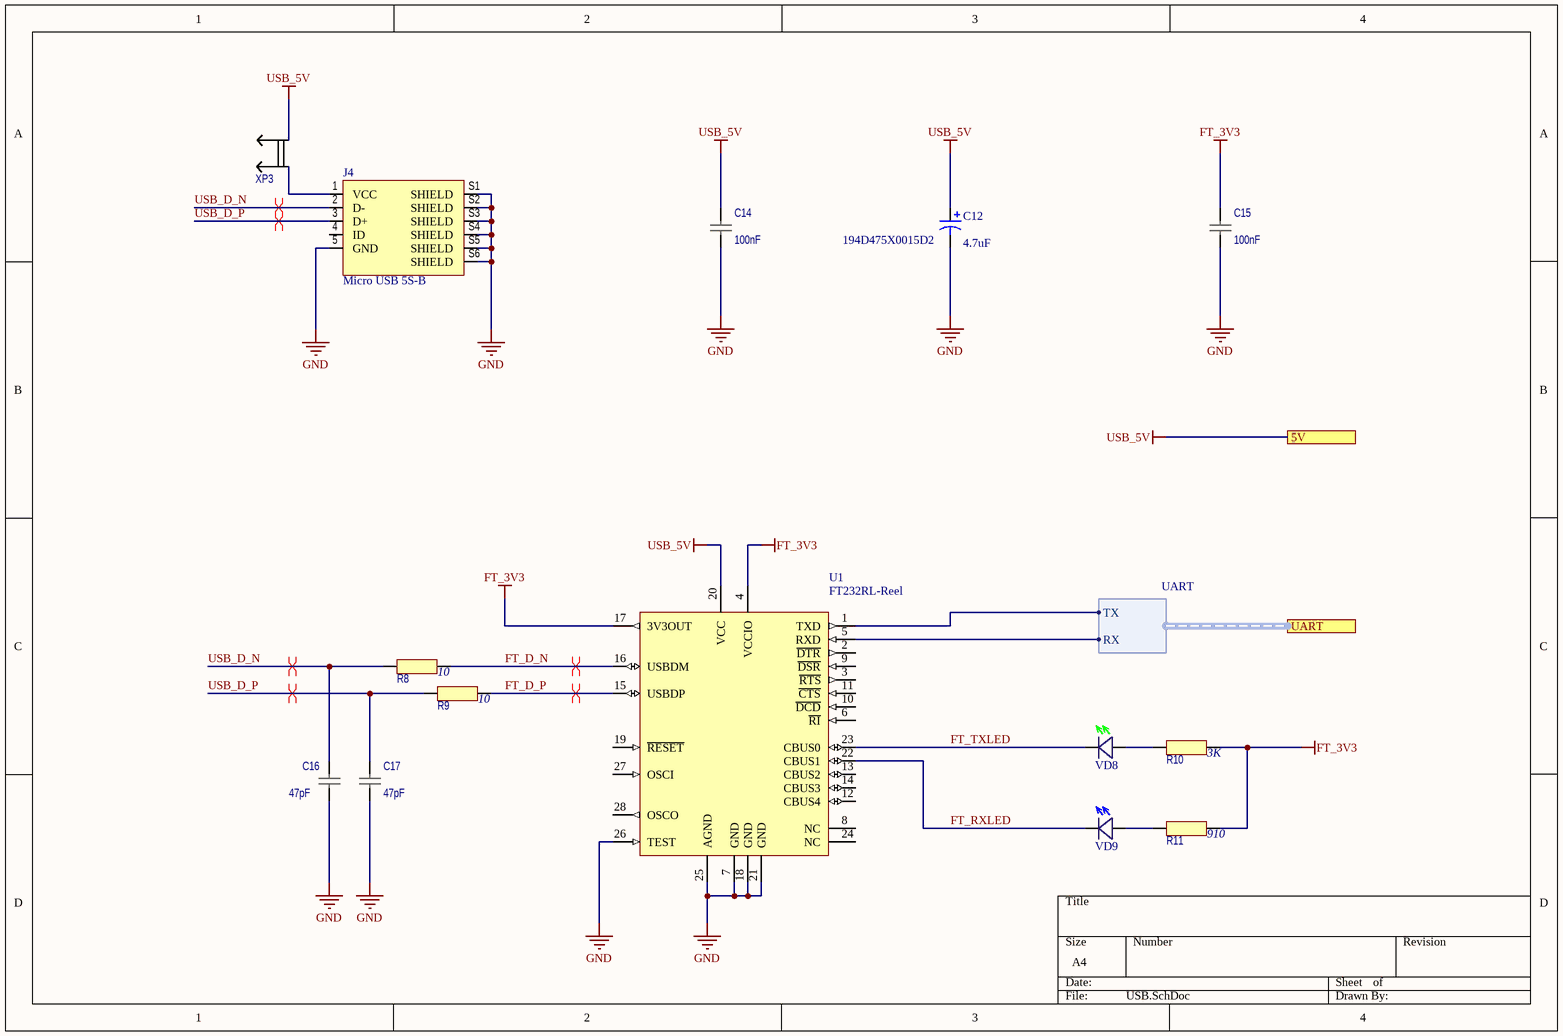
[diagram p5: USB.SchDoc]

### Parts
C12  194D475X0015D2  value 4.7uF  [D]
C14  value 100nF  [C0805]  (hidden comment: C0805)
C15  value 100nF  [C0805]  (hidden comment: C0805)
C16  value 47pF  [C0805]  (hidden comment: C0805)
C17  value 47pF  [C0805]  (hidden comment: C0805)
J4  Micro USB 5S-B  [KLS1-233-0-0-1-T]
R8  value 10  [R0805]  (hidden comment: R0805)
R9  value 10  [R0805]  (hidden comment: R0805)
R10  value 3K  [R0805]  (hidden comment: R0805)
R11  value 910  [R0805]  (hidden comment: R0805)
U1  FT232RL-Reel  [SSOP-28_N]
VD8  TO-1608BC-PG  [TO-1608BC-PG]  (value not drawn)
VD9  TO-1608BC-BF  [TO-1608BC-BF]  (value not drawn)
XP3  Замыкатель MJ-O-8KLS  [PLS-2]  (value not drawn)

### Ports
5V, UART (harness UART)

### Harnesses
UART: TX, RX

### Nets
FT_3V3: C15.2 R10.1 R11.1 U1.4(VCCIO) U1.17(3V3OUT)
GND: C12.2 C14.1 C15.1 C16.1 C17.1 J4.5(GND) J4.S1(SHIELD) J4.S2(SHIELD) J4.S3(SHIELD) J4.S4(SHIELD) J4.S5(SHIELD) J4.S6(SHIELD) U1.7(GND) U1.18(GND) U1.21(GND) U1.25(AGND) U1.26(TEST)
USB_5V: C12.1 C14.2 U1.20(VCC) XP3.2 ; port 5V  [project net C5V]
FT_D_N: R8.1 U1.16(USBDM)
FT_D_P: R9.1 U1.15(USBDP)
FT_RXLED: U1.22(CBUS1) VD9.-
FT_TXLED: U1.23(CBUS0) VD8.-
RPi_GPIO14: U1.5(RXD) ; port UART.RX
RPi_GPIO15: U1.1(TXD) ; port UART.TX
USB_D_N: C16.2 J4.2(D-) R8.2
USB_D_P: C17.2 J4.3(D+) R9.2
NetJ4_1: J4.1(VCC) XP3.1
NetR10_2: R10.2 VD8.+
NetR11_2: R11.2 VD9.+

Not connected (* = marked no-connect by the designer): J4 4(ID); U1 2(~{DTR}) 3(~{RTS}) 6(~{RI}) 8(NC) 9(~{DSR}) 10(~{DCD}) 11(~{CTS}) 12(CBUS4) 13(CBUS2) 14(CBUS3) 19(~{RESET}) 24(NC) 27(OSCI) 28(OSCO)

### Layout directives
differential pair: FT_D_N, FT_D_P, USB_D_N, USB_D_P

### Library data of the parts
C12 = 194D475X0015D2: as C7 on sheet Power; Published: 19-Mar-2004; PackageReference: D; Publisher: Altium Limited; DatasheetDocument: 05-Jul-2002; ComponentLink1Description: Manufacturer Link; ComponentLink1URL: http://www.vishay.com/; ComponentLink2Description: Datasheet; ComponentLink2URL: http://www.vishay.com/docs/40000/194d.pdf
C14-C17 = C0805: Tolerance: %; Voltage: B; Case: *; Dielectric: *; Mount: *; PartNumber: *
J4 = KLS1-233-0-0-1-T
U1 = FT232RL-Reel: USB UART Asynchronous Serial Data Transfer Chip, 28-pin SSOP, Tape and Reel; Manufacturer: FTDI; DatasheetVersion: ver 2.10, Mar-2012; PackageVersion: Mar-12; PackageReference: SSOP-28; PackageDescription: 28-Pin Small Outline Package 0.65 mm Pitch; PartNumber: FT232RL-Reel; ComponentLink1Description: Manufacturer URL; ComponentLink1URL: http://www.ftdichip.com/; ComponentLink2Description: Datasheet; ComponentLink2URL: http://www.ftdichip.com/Support/Documents/DataSheets/ICs/DS_FT232R.pdf
VD8 = TO-1608BC-PG: as VD3 on sheet Power
VD9 = TO-1608BC-BF: LED SMD 1608 247мКд, 120°, 468нМ (Blue)
XP3 = JP2: Company: KLS electronic co ltd; PartNumber: MJ-O-8KLS
R8-R11 = R0805: Case: *; Mount: *; PartNumber: *; Power: *; Tolerance: *

## Sheet Peripherals.SchDoc
size A3; SheetNumber: 8; SheetTotal: 11; SPICEModelCacheDRZDZRIN: <root> / <DocumentId>DRZDZRIN</DocumentId> / </root>
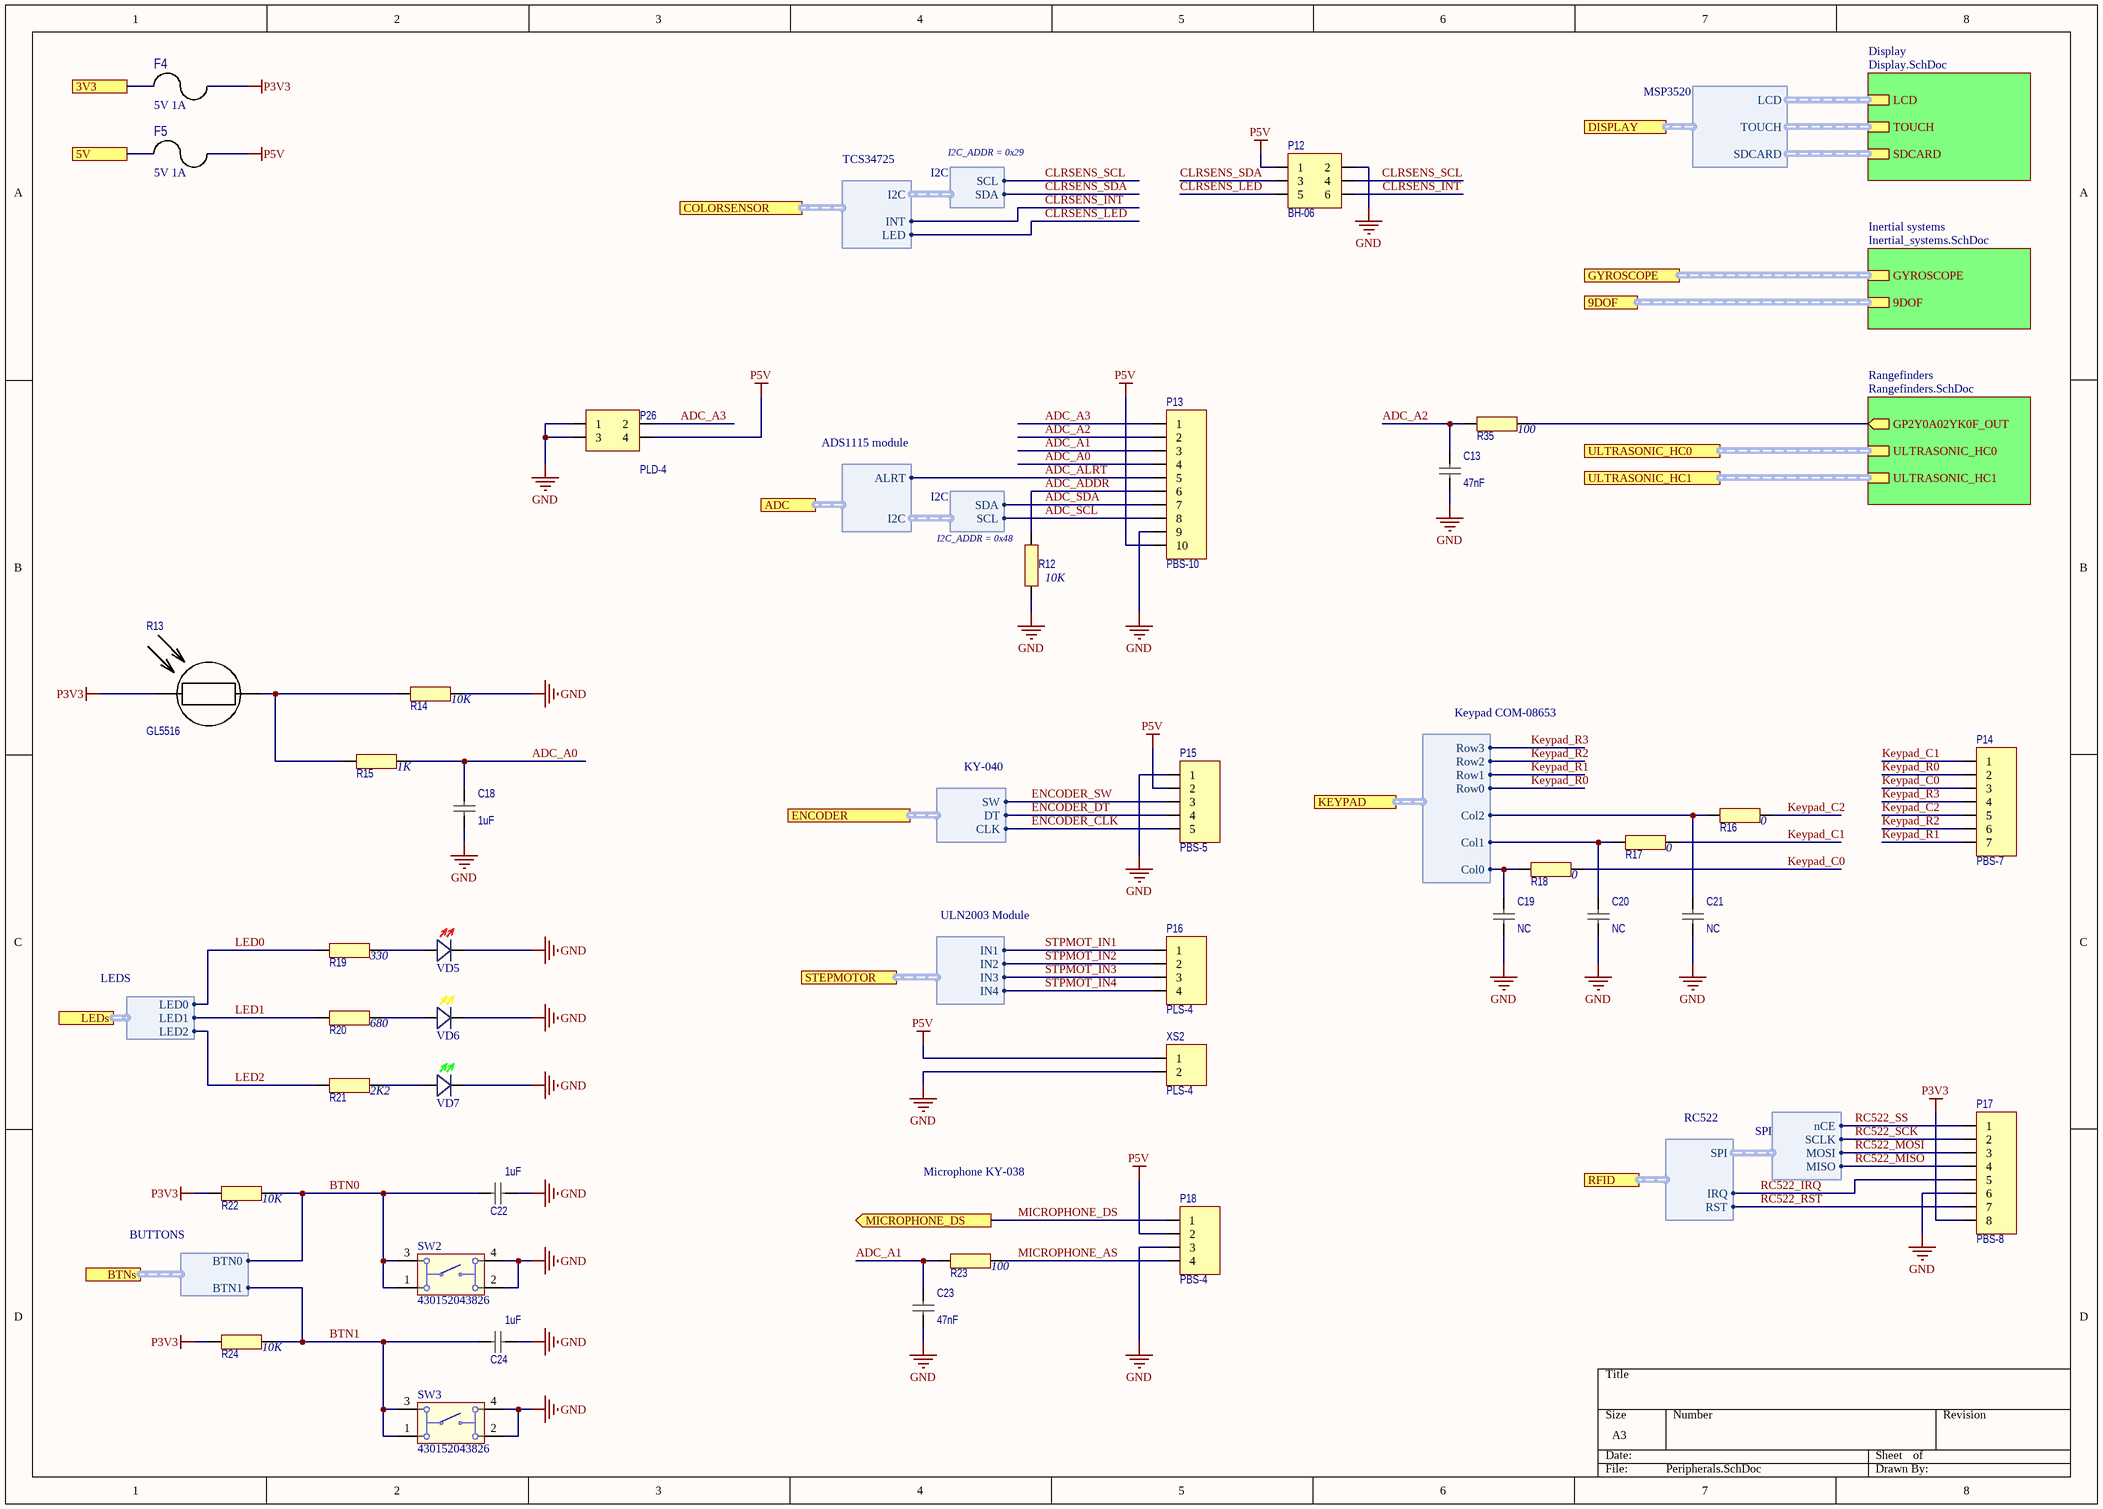
[diagram p6: Peripherals.SchDoc]

### Parts
C13  value 47nF  [C0805]  (hidden comment: C0805)
C18  value 1uF  [C0805]  (hidden comment: C0805)
C19  value NC  [C0805]  (hidden comment: C0805)
C20  value NC  [C0805]  (hidden comment: C0805)
C21  value NC  [C0805]  (hidden comment: C0805)
C22  value 1uF  [C0805]  (hidden comment: C0805)
C23  value 47nF  [C0805]  (hidden comment: C0805)
C24  value 1uF  [C0805]  (hidden comment: C0805)
F4  5V 1A  [FUSC6127X269N]
F5  5V 1A  [FUSC6127X269N]
P12  BH-06  [BH-06]
P13  PBS-10  [PBS-10]
P14  PBS-7  [PBS-7]
P15  PBS-5  [PBS-5]
P16  PLS-4  [PLS-4]
P17  PBS-8  [PBS-8]
P18  PBS-4  [PBS-4]
P26  PLD-4  [PLD-4]
R12  value 10K  [R0805]  (hidden comment: R0805)
R13  GL5516  [GL5516]
R14  value 10K  [R0805]  (hidden comment: R0805)
R15  value 1K  [R0805]  (hidden comment: R0805)
R16  value 0  [R0805]  (hidden comment: R0805)
R17  value 0  [R0805]  (hidden comment: R0805)
R18  value 0  [R0805]  (hidden comment: R0805)
R19  value 330  [R0805]  (hidden comment: R0805)
R20  value 680  [R0805]  (hidden comment: R0805)
R21  value 2K2  [R0805]  (hidden comment: R0805)
R22  value 10K  [R0805]  (hidden comment: R0805)
R23  value 100  [R0805]  (hidden comment: R0805)
R24  value 10K  [R0805]  (hidden comment: R0805)
R35  value 100  [R0805]  (hidden comment: R0805)
SW2  430152043826  [430152043826]
SW3  430152043826  [430152043826]
VD5  TO-1608BC-MRE  [TO-1608BC-MRE]  (value not drawn)
VD6  TO-1608BC-MYF  [TO-1608BC-MYF]  (value not drawn)
VD7  TO-1608BC-PG  [TO-1608BC-PG]  (value not drawn)
XS2  PLS-4  [PLS-2]

### Sub-sheets
Display = Display.SchDoc: SDCARD (harness SPI), TOUCH (harness TOUCH), LCD (harness LCD)
Inertial systems = Inertial_systems.SchDoc: GYROSCOPE (harness GY-50 L3GD20 Gyro), 9DOF (harness 9DOF)
Rangefinders = Rangefinders.SchDoc: ULTRASONIC_HC0 (harness HC-SR04), ULTRASONIC_HC1 (harness HC-SR04), GP2Y0A02YK0F_OUT (out)

### Ports
3V3, 5V, 9DOF (harness 9DOF), ADC (harness ADS1115 module), BTNs (harness BUTTONS), COLORSENSOR (harness TCS34725), DISPLAY (harness MSP3520), ENCODER (harness KY-040), GYROSCOPE (harness GY-50 L3GD20 Gyro), KEYPAD (harness Keypad COM-08653), LEDs (harness LEDS), MICROPHONE_DS (out), RFID (harness RC522), STEPMOTOR (harness ULN2003 Module), ULTRASONIC_HC0 (harness HC-SR04), ULTRASONIC_HC1 (harness HC-SR04)

### Harnesses
RC522: IRQ, RST, SPI
Keypad COM-08653: Col0, Col1, Col2, Row0, Row1, Row2, Row3
KY-040: CLK, SW, DT
ADS1115 module: I2C, ALRT
ULN2003 Module: IN1, IN2, IN3, IN4
BUTTONS: BTN0, BTN1
LEDS: LED0, LED1, LED2
I2C: SCL, SDA
SPI: nCE, MISO, MOSI, SCLK
MSP3520: LCD, TOUCH, SDCARD
TCS34725: I2C, INT, LED

### Nets
3V3: F4.1 ; port 3V3
C5V: F5.1 ; port 5V
GND: C13.1 C18.1 C19.1 C20.1 C21.1 C22.1 C23.1 C24.1 P12.2 P13.9 P15.1 P17.6 P18.3 P26.1 P26.3 R12.2 R14.1 SW2.2 SW2.4 SW3.2 SW3.4 VD5.- VD6.- VD7.- XS2.2
P3V3: F4.2 P17.8 R13.1 R22.2 R24.2
P5V: F5.2 P12.1 P13.10 P15.2 P18.2 P26.4 XS2.1
ADC_A0: C18.2 P13.4 R15.1
ADC_A1: C23.2 P13.3 R23.2
ADC_A2: C13.2 P13.2 R35.2
ADC_A3: P13.1 P26.2
ADC_ADDR: P13.6 R12.1
ADC_ALRT: P13.5 ; port ADC.ALRT  [project net ADC.ALRT]
ADC_SCL: P13.8 ; harness I2C.SCL
ADC_SDA: P13.7 ; harness I2C.SDA
BTN0: C22.2 R22.1 SW2.1 SW2.3 ; port BTNs.BTN0
BTN1: C24.2 R24.1 SW3.1 SW3.3 ; port BTNs.BTN1
CLRSENS_INT: P12.6 ; port COLORSENSOR.INT
CLRSENS_LED: P12.5
CLRSENS_SCL: P12.4 ; harness I2C.SCL
CLRSENS_SDA: P12.3 ; harness I2C.SDA
ENCODER_CLK: P15.5 ; port ENCODER.CLK  [project net ENCODER.CLK]
ENCODER_DT: P15.4 ; port ENCODER.DT  [project net ENCODER.DT]
ENCODER_SW: P15.3 ; port ENCODER.SW  [project net ENCODER.SW]
KEYPAD.Col0: C19.2 R18.2 ; port KEYPAD.Col0
KEYPAD.Col1: C20.2 R17.2 ; port KEYPAD.Col1
KEYPAD.Col2: C21.2 R16.2 ; port KEYPAD.Col2
Keypad_C0: P14.3 R18.1
Keypad_C1: P14.1 R17.1
Keypad_C2: P14.5 R16.1
Keypad_R0: P14.2 ; port KEYPAD.Row0  [project net KEYPAD.Row0]
Keypad_R1: P14.7 ; port KEYPAD.Row1  [project net KEYPAD.Row1]
Keypad_R2: P14.6 ; port KEYPAD.Row2  [project net KEYPAD.Row2]
Keypad_R3: P14.4 ; port KEYPAD.Row3  [project net KEYPAD.Row3]
LED0: R19.2 ; port LEDs.LED0
LED1: R20.2 ; port LEDs.LED1
LED2: R21.2 ; port LEDs.LED2
MICROPHONE_AS: P18.4 R23.1
MICROPHONE_DS: P18.1 ; port MICROPHONE_DS
RC522_IRQ: P17.5 ; port RFID.IRQ
RC522_MISO: P17.4 ; harness SPI.MISO
RC522_MOSI: P17.3 ; harness SPI.MOSI
RC522_RST: P17.7 ; port RFID.RST
RC522_SCK: P17.2 ; harness SPI.SCLK
RC522_SS: P17.1 ; harness SPI.nCE
STPMOT_IN1: P16.1 ; port STEPMOTOR.IN1  [project net STEPMOTOR.IN1]
STPMOT_IN2: P16.2 ; port STEPMOTOR.IN2  [project net STEPMOTOR.IN2]
STPMOT_IN3: P16.3 ; port STEPMOTOR.IN3  [project net STEPMOTOR.IN3]
STPMOT_IN4: P16.4 ; port STEPMOTOR.IN4  [project net STEPMOTOR.IN4]
NetR13_2: R13.2 R14.2 R15.2
NetR19_1: R19.1 VD5.+
NetR20_1: R20.1 VD6.+
NetR21_1: R21.1 VD7.+
NetR35_1: R35.1 ; sheet Rangefinders/GP2Y0A02YK0F_OUT

### Buses and harness runs
harness port 9DOF = sheet Inertial systems/9DOF
harness port GYROSCOPE = sheet Inertial systems/GYROSCOPE
harness port ULTRASONIC_HC0 = sheet Rangefinders/ULTRASONIC_HC0
harness port ULTRASONIC_HC1 = sheet Rangefinders/ULTRASONIC_HC1

### Notes on the sheet
- I2C_ADDR = 0x29
- (near R12) I2C_ADDR = 0x48
- Microphone KY-038

### Library data of the parts
C13 C18-C24 = C0805: Tolerance: %; Voltage: B; Case: *; Dielectric: *; Mount: *; PartNumber: *
F4 F5 = F: 045303.5MR
R13 = Light Sensor: PartNumber: GL5516
SW2 SW3 = 430152043826: WS-TASV SMD Tact Switch 6X6 mm; NoPins: 04; PackageReference: 430152043826; PartNumber: 430152043826; ComponentLink1Description: Manufacturer URL; ComponentLink1URL: http://www.we-online.com; ComponentLink2Description: Datasheet; ComponentLink2URL: http://katalog.we-online.de/em/datasheet/4301x2.pdf
VD5 = TO-1608BC-MRE: as VD1 on sheet Power
VD6 = TO-1608BC-MYF: as VD2 on sheet Power
VD7 = TO-1608BC-PG: as VD3 on sheet Power
XS2 = PLS-2
R12 R14-R24 R35 = R0805: Case: *; Mount: *; PartNumber: *; Power: *; Tolerance: *

## Sheet Inertial_systems.SchDoc
size A4; SheetNumber: 9; SheetTotal: 11
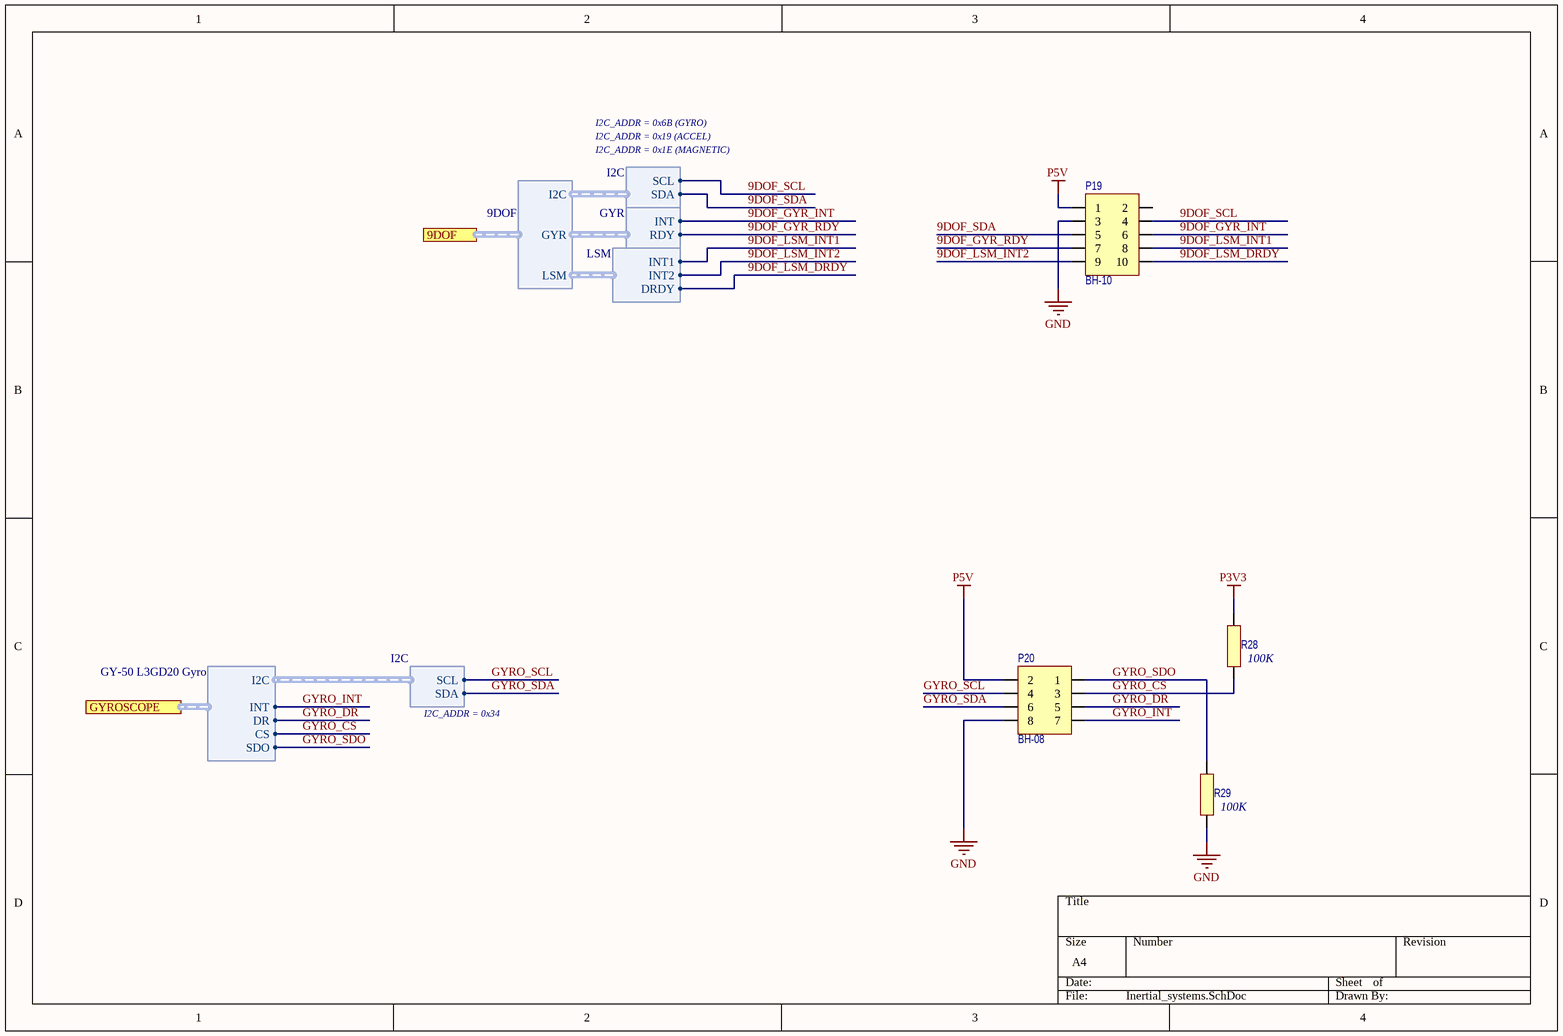
[diagram p7: Inertial_systems.SchDoc]

### Parts
P19  BH-10  [BH-10]
P20  BH-08  [BH-08]
R28  value 100K  [R0805]  (hidden comment: R0805)
R29  value 100K  [R0805]  (hidden comment: R0805)

### Ports
9DOF (harness 9DOF), GYROSCOPE (harness GY-50 L3GD20 Gyro)

### Harnesses
GY-50 L3GD20 Gyro: SDO, CS, I2C, DR, INT
I2C: SCL, SDA
9DOF: I2C, GYR, LSM
GYR: INT, RDY
LSM: INT1, DRDY, INT2

### Nets
GND: P19.3 P20.8 R29.1
P3V3: R28.2
P5V: P19.1 P20.2
9DOF_GYR_INT: P19.6 ; harness GYR.INT
9DOF_GYR_RDY: P19.7 ; harness GYR.RDY
9DOF_LSM_DRDY: P19.10 ; harness LSM.DRDY
9DOF_LSM_INT1: P19.8 ; harness LSM.INT1
9DOF_LSM_INT2: P19.9 ; harness LSM.INT2
9DOF_SCL: P19.4 ; harness I2C.SCL
9DOF_SDA: P19.5 ; harness I2C.SDA
GYRO_CS: P20.3 R28.1 ; port GYROSCOPE.CS
GYRO_DR: P20.5 ; port GYROSCOPE.DR
GYRO_INT: P20.7 ; port GYROSCOPE.INT
GYRO_SCL: P20.4 ; harness I2C.SCL
GYRO_SDA: P20.6 ; harness I2C.SDA
GYRO_SDO: P20.1 R29.2 ; port GYROSCOPE.SDO

Not connected (* = marked no-connect by the designer): P19 2

### Notes on the sheet
- I2C_ADDR = 0x6B (GYRO)
- I2C_ADDR = 0x19 (ACCEL)
- I2C_ADDR = 0x1E (MAGNETIC)
- I2C_ADDR = 0x34

### Library data of the parts
R28 R29 = R0805: Case: *; Mount: *; PartNumber: *; Power: *; Tolerance: *

## Sheet Rangefinders.SchDoc
size A4; SheetNumber: 9; SheetTotal: 11
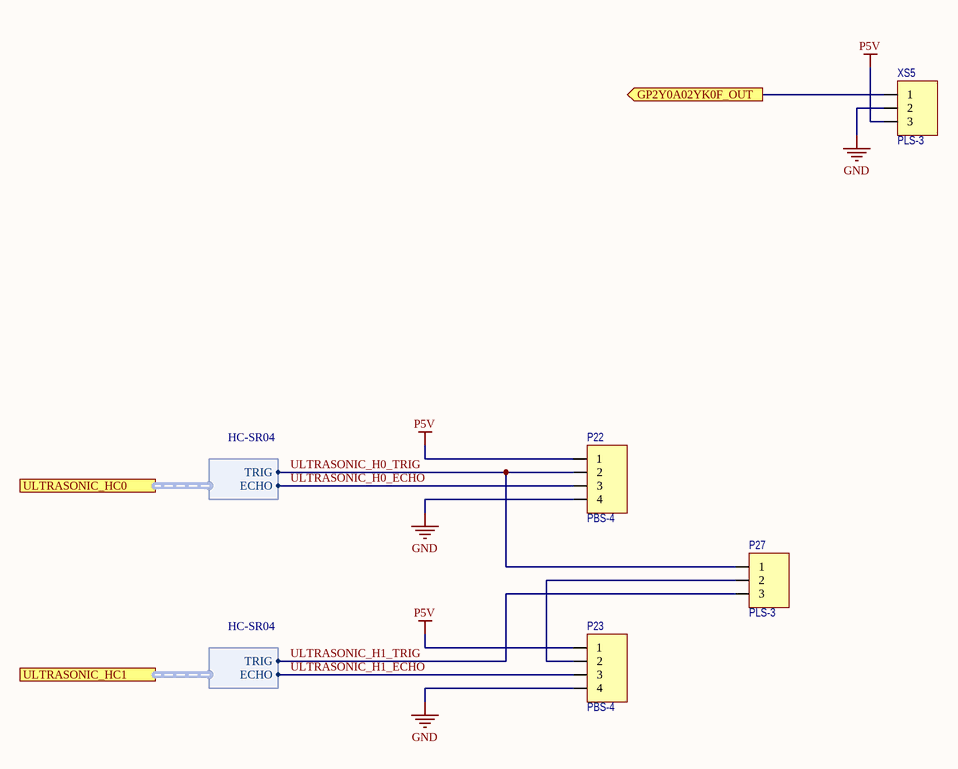
[diagram p8: Rangefinders.SchDoc]

### Parts
P22  PBS-4  [PBS-4]
P23  PBS-4  [PBS-4]
P27  PLS-3  [PLS-3]
XS5  PLS-3  [PBS2-3]

### Ports
GP2Y0A02YK0F_OUT (out), ULTRASONIC_HC0 (harness HC-SR04), ULTRASONIC_HC1 (harness HC-SR04)

### Harnesses
HC-SR04: ECHO, TRIG

### Nets
GND: P22.4 P23.4 XS5.2
P5V: P22.1 P23.1 XS5.3
ULTRASONIC_H0_ECHO: P22.3 ; port ULTRASONIC_HC0.ECHO
ULTRASONIC_H0_TRIG: P22.2 P27.1 ; port ULTRASONIC_HC0.TRIG
ULTRASONIC_H1_ECHO: P23.3 ; port ULTRASONIC_HC1.ECHO
ULTRASONIC_H1_TRIG: P27.3 ; port ULTRASONIC_HC1.TRIG
NetP23_2: P23.2 P27.2
NetR35_1: XS5.1 ; port GP2Y0A02YK0F_OUT

### Library data of the parts
XS5 = PBS2-3

## Sheet Display.SchDoc
size A4; SheetNumber: 10; SheetTotal: 11
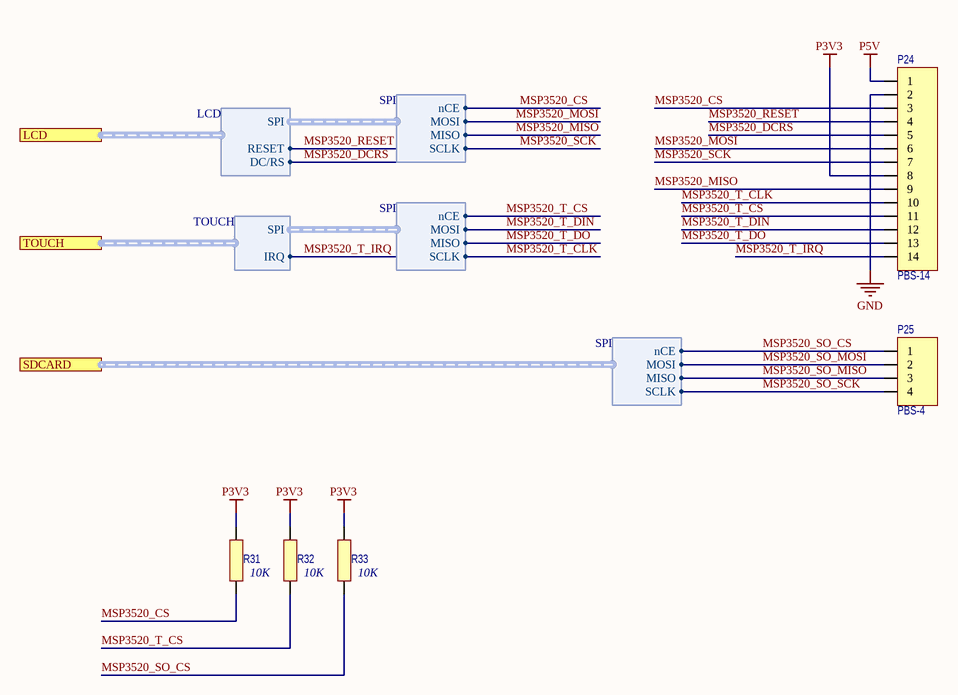
[diagram p9: Display.SchDoc]

### Parts
P24  PBS-14  [PBS-14]
P25  PBS-4  [PBS-4]
R31  value 10K  [R0805]  (hidden comment: R0805)
R32  value 10K  [R0805]  (hidden comment: R0805)
R33  value 10K  [R0805]  (hidden comment: R0805)

### Ports
LCD (harness LCD), SDCARD (harness SPI), TOUCH (harness TOUCH)

### Harnesses
SPI: nCE, MISO, MOSI, SCLK
LCD: SPI, RESET, DC/RS
TOUCH: SPI, IRQ

### Nets
GND: P24.2
P3V3: P24.8 R31.2 R32.2 R33.2
P5V: P24.1
MSP3520_CS: P24.3 R31.1 ; harness SPI.nCE
MSP3520_DCRS: P24.5 ; port LCD.DC/RS
MSP3520_MISO: P24.9 ; harness SPI.MISO
MSP3520_MOSI: P24.6 ; harness SPI.MOSI
MSP3520_RESET: P24.4 ; port LCD.RESET
MSP3520_SCK: P24.7 ; harness SPI.SCLK
MSP3520_SO_CS: P25.1 R33.1 ; port SDCARD.nCE
MSP3520_SO_MISO: P25.3 ; port SDCARD.MISO
MSP3520_SO_MOSI: P25.2 ; port SDCARD.MOSI
MSP3520_SO_SCK: P25.4 ; port SDCARD.SCLK
MSP3520_T_CLK: P24.10 ; harness SPI.SCLK
MSP3520_T_CS: P24.11 R32.1 ; harness SPI.nCE
MSP3520_T_DIN: P24.12 ; harness SPI.MOSI
MSP3520_T_DO: P24.13 ; harness SPI.MISO
MSP3520_T_IRQ: P24.14 ; port TOUCH.IRQ

### Library data of the parts
R31-R33 = R0805: Case: *; Mount: *; PartNumber: *; Power: *; Tolerance: *

## Sheet STM32-Nucleo-144.SchDoc
size A3; SheetNumber: 7; SheetTotal: 11
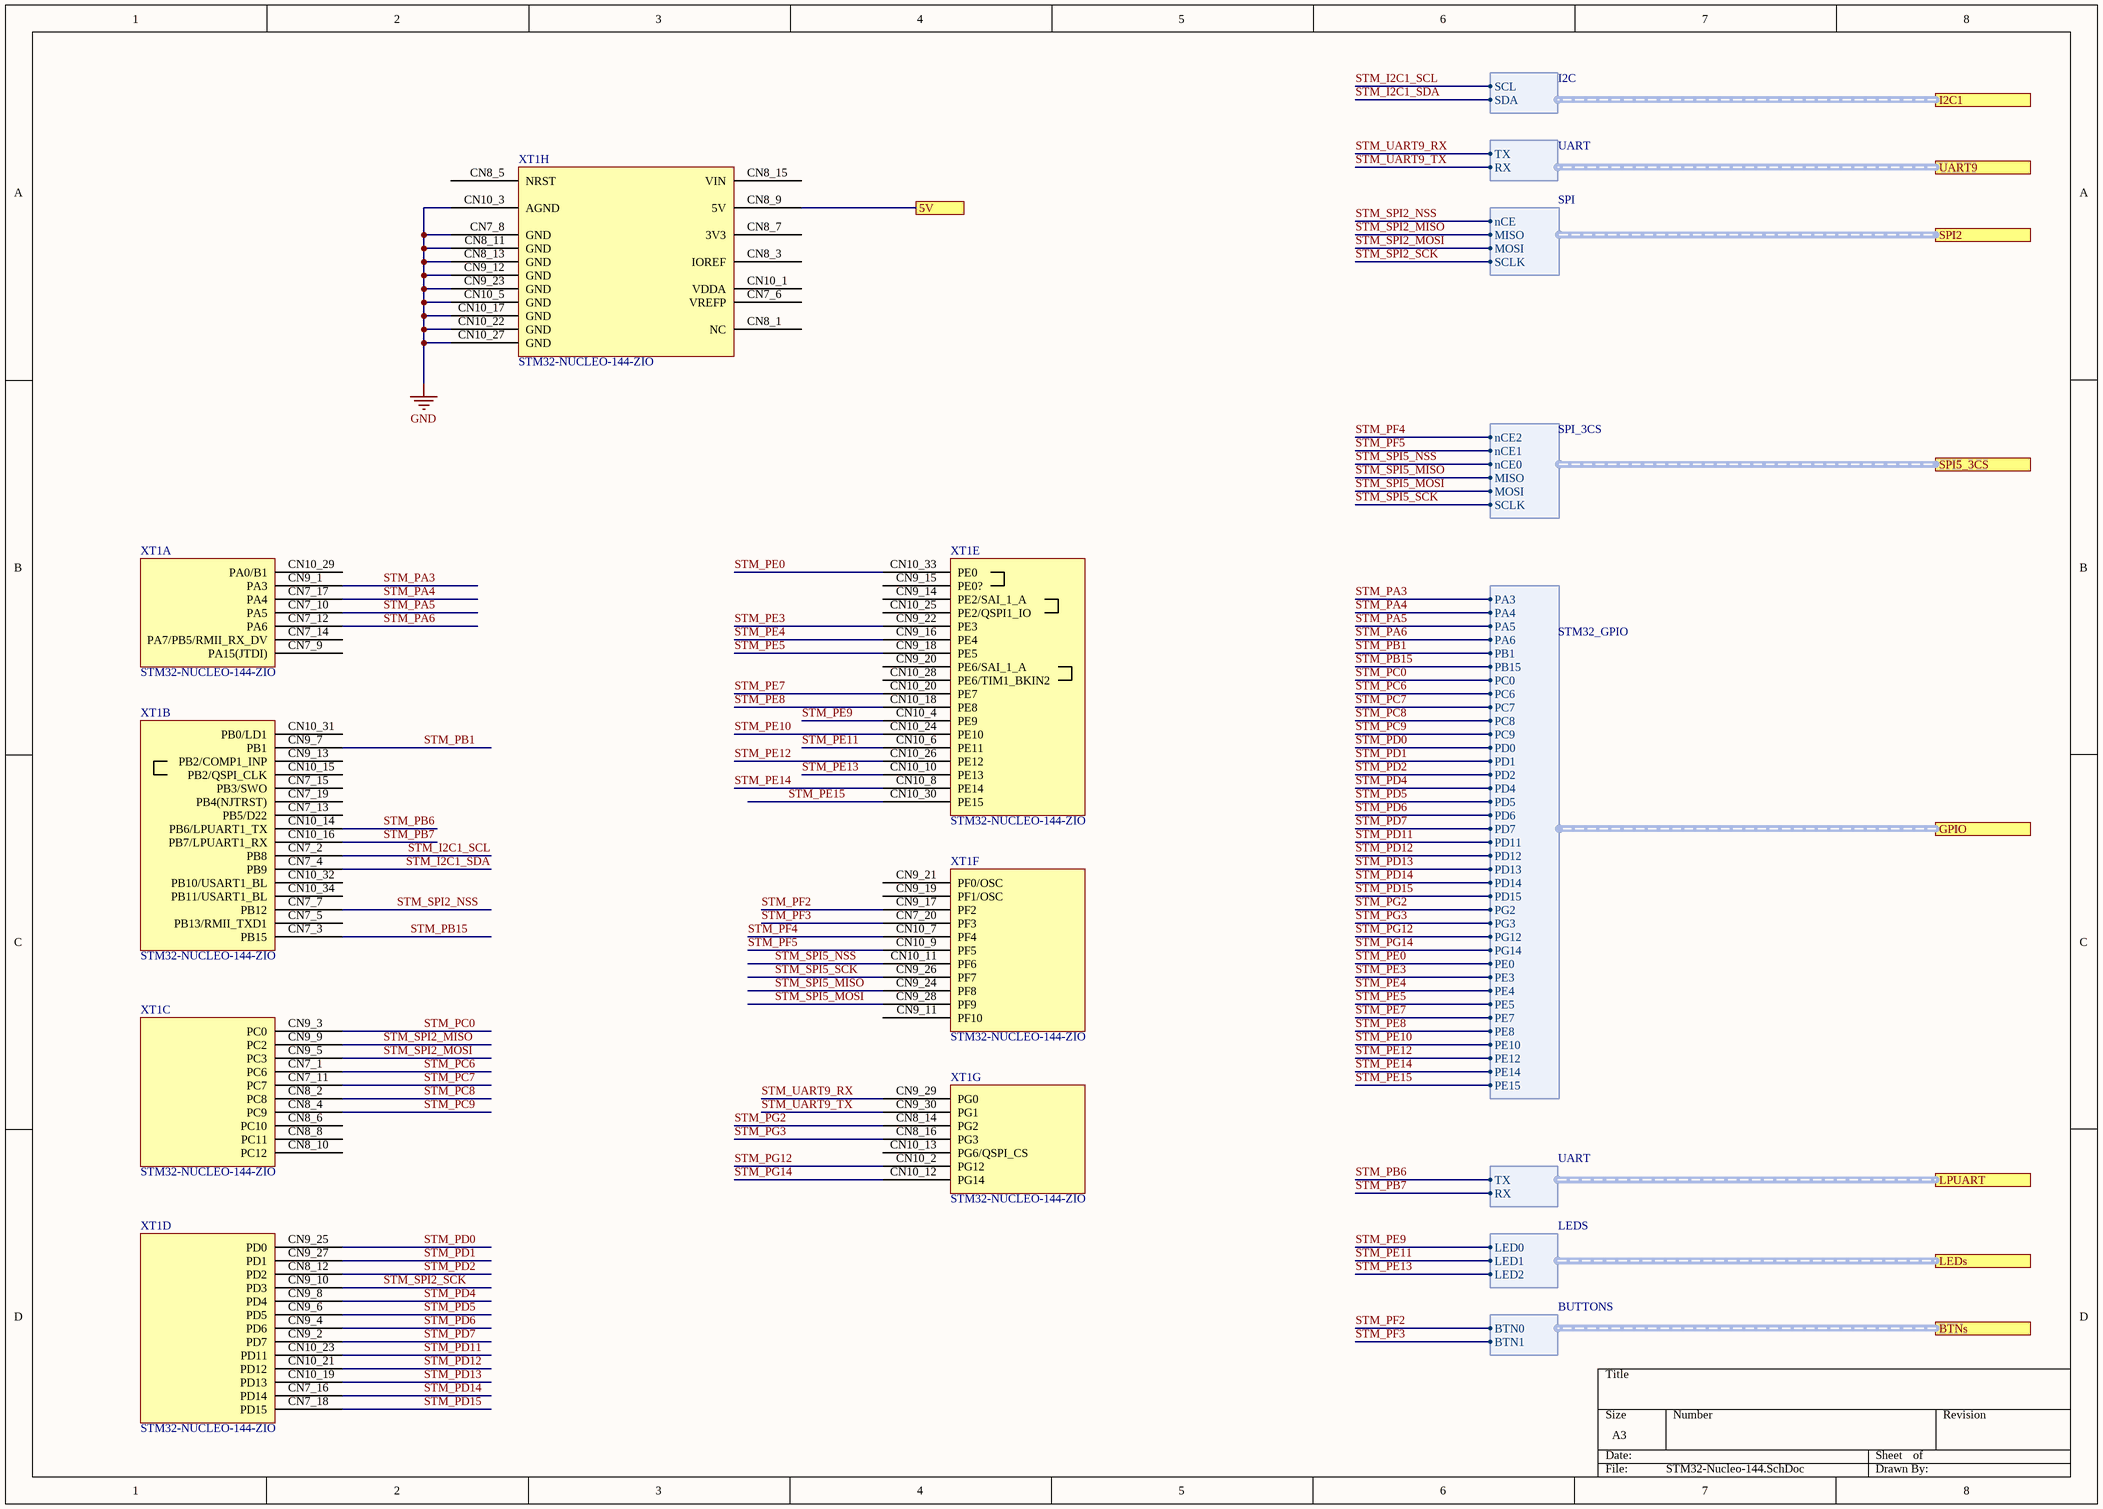
[diagram p10: STM32-Nucleo-144.SchDoc]

### Parts
XT1  STM32-NUCLEO-144-ZIO  [STM32-NUCLEO-144-ZIO]  (parts A,B,C,D,E,F,G,H of 8)

### Ports
5V, BTNs (harness BUTTONS), GPIO (harness STM32_GPIO), I2C1 (harness I2C), LEDs (harness LEDS), LPUART (harness UART), SPI2 (harness SPI), SPI5_3CS (harness SPI_3CS), UART9 (harness UART)

### Harnesses
SPI_3CS: nCE2, nCE1, nCE0, MISO, MOSI, SCLK
I2C: SCL, SDA
UART: TX, RX
SPI: nCE, MISO, MOSI, SCLK
LEDS: LED0, LED1, LED2
BUTTONS: BTN0, BTN1
STM32_GPIO: PB1, PB15, PC0, PC6, PC7, PC8, PC9, PD0, PD1, PD2, PD4, PD5, PD6, PD11, PD12, PD13, PD14, PD15, PG2, PG3, PG12, PG14, PE0, PE3, PE4, PE5, PE7, PE8, PE10, PE12, PE14, PE15, PD7, PA6, PA3, PA4, PA5

### Nets
C5V: XT1.CN8_9(5V) ; port 5V
GND: XT1.CN7_8(GND) XT1.CN8_11(GND) XT1.CN8_13(GND) XT1.CN9_12(GND) XT1.CN9_23(GND) XT1.CN10_3(AGND) XT1.CN10_5(GND) XT1.CN10_17(GND) XT1.CN10_22(GND) XT1.CN10_27(GND)
STM_I2C1_SCL: XT1.CN7_2(PB8) ; port I2C1.SCL  [project net 9DOF.I2C.SCL]
STM_I2C1_SDA: XT1.CN7_4(PB9) ; port I2C1.SDA  [project net 9DOF.I2C.SDA]
STM_PA3: XT1.CN9_1(PA3) ; port GPIO.PA3  [project net 9DOF.LSM.INT2]
STM_PA4: XT1.CN7_17(PA4) ; port GPIO.PA4  [project net 9DOF.GYR.INT]
STM_PA5: XT1.CN7_10(PA5) ; port GPIO.PA5  [project net 9DOF.LSM.DRDY]
STM_PA6: XT1.CN7_12(PA6) ; port GPIO.PA6  [project net 9DOF.LSM.INT1]
STM_PB1: XT1.CN9_7(PB1) ; port GPIO.PB1  [project net 9DOF.GYR.RDY]
STM_PB6: XT1.CN10_14(PB6/LPUART1_TX) ; port LPUART.TX  [project net RPi_GPIO14]
STM_PB7: XT1.CN10_16(PB7/LPUART1_RX) ; port LPUART.RX  [project net RPi_GPIO15]
STM_PB15: XT1.CN7_3(PB15) ; port GPIO.PB15  [project net MICROPHONE_DS]
STM_PC0: XT1.CN9_3(PC0) ; port GPIO.PC0  [project net ADC.ALRT]
STM_PC6: XT1.CN7_1(PC6) ; port GPIO.PC6  [project net RFID.IRQ]
STM_PC7: XT1.CN7_11(PC7) ; port GPIO.PC7  [project net RFID.RST]
STM_PC8: XT1.CN8_2(PC8) ; port GPIO.PC8  [project net DISPLAY.LCD.DC/RS]
STM_PC9: XT1.CN8_4(PC9) ; port GPIO.PC9  [project net DISPLAY.LCD.RESET]
STM_PD0: XT1.CN9_25(PD0) ; port GPIO.PD0  [project net DISPLAY.TOUCH.IRQ]
STM_PD1: XT1.CN9_27(PD1) ; port GPIO.PD1  [project net KEYPAD.Col0]
STM_PD2: XT1.CN8_12(PD2) ; port GPIO.PD2  [project net KEYPAD.Col1]
STM_PD4: XT1.CN9_8(PD4) ; port GPIO.PD4  [project net KEYPAD.Col2]
STM_PD5: XT1.CN9_6(PD5) ; port GPIO.PD5  [project net KEYPAD.Row0]
STM_PD6: XT1.CN9_4(PD6) ; port GPIO.PD6  [project net KEYPAD.Row1]
STM_PD7: XT1.CN9_2(PD7) ; port GPIO.PD7  [project net KEYPAD.Row2]
STM_PD11: XT1.CN10_23(PD11) ; port GPIO.PD11  [project net KEYPAD.Row3]
STM_PD12: XT1.CN10_21(PD12) ; port GPIO.PD12
STM_PD13: XT1.CN10_19(PD13) ; port GPIO.PD13
STM_PD14: XT1.CN7_16(PD14) ; port GPIO.PD14
STM_PD15: XT1.CN7_18(PD15) ; port GPIO.PD15
STM_PE0: XT1.CN10_33(PE0) ; port GPIO.PE0  [project net COLORSENSOR.INT]
STM_PE3: XT1.CN9_22(PE3) ; port GPIO.PE3  [project net COLORSENSOR.LED]
STM_PE4: XT1.CN9_16(PE4) ; port GPIO.PE4  [project net GYROSCOPE.CS]
STM_PE5: XT1.CN9_18(PE5) ; port GPIO.PE5  [project net GYROSCOPE.INT]
STM_PE7: XT1.CN10_20(PE7) ; port GPIO.PE7  [project net GYROSCOPE.DR]
STM_PE8: XT1.CN10_18(PE8) ; port GPIO.PE8  [project net GYROSCOPE.SDO]
STM_PE9: XT1.CN10_4(PE9) ; port LEDs.LED0  [project net LED0]
STM_PE10: XT1.CN10_24(PE10) ; port GPIO.PE10  [project net STEPMOTOR.IN1]
STM_PE11: XT1.CN10_6(PE11) ; port LEDs.LED1  [project net LED1]
STM_PE12: XT1.CN10_26(PE12) ; port GPIO.PE12  [project net STEPMOTOR.IN2]
STM_PE13: XT1.CN10_10(PE13) ; port LEDs.LED2  [project net LED2]
STM_PE14: XT1.CN10_8(PE14) ; port GPIO.PE14  [project net STEPMOTOR.IN3]
STM_PE15: XT1.CN10_30(PE15) ; port GPIO.PE15  [project net STEPMOTOR.IN4]
STM_PF2: XT1.CN9_17(PF2) ; port BTNs.BTN0  [project net BTN0]
STM_PF3: XT1.CN7_20(PF3) ; port BTNs.BTN1  [project net BTN1]
STM_PF4: XT1.CN10_7(PF4) ; port SPI5_3CS.nCE2  [project net DISPLAY.SDCARD.nCE]
STM_PF5: XT1.CN10_9(PF5) ; port SPI5_3CS.nCE1  [project net DISPLAY.TOUCH.SPI.nCE]
STM_PG2: XT1.CN8_14(PG2) ; port GPIO.PG2
STM_PG3: XT1.CN8_16(PG3) ; port GPIO.PG3  [project net ENCODER.DT]
STM_PG12: XT1.CN10_2(PG12) ; port GPIO.PG12  [project net ENCODER.SW]
STM_PG14: XT1.CN10_12(PG14) ; port GPIO.PG14  [project net ENCODER.CLK]
STM_SPI2_MISO: XT1.CN9_9(PC2) ; port SPI2.MISO  [project net RFID.SPI.MISO]
STM_SPI2_MOSI: XT1.CN9_5(PC3) ; port SPI2.MOSI  [project net RFID.SPI.MOSI]
STM_SPI2_NSS: XT1.CN7_7(PB12) ; port SPI2.nCE  [project net RFID.SPI.nCE]
STM_SPI2_SCK: XT1.CN9_10(PD3) ; port SPI2.SCLK  [project net RFID.SPI.SCLK]
STM_SPI5_MISO: XT1.CN9_24(PF8) ; port SPI5_3CS.MISO  [project net DISPLAY.LCD.SPI.MISO]
STM_SPI5_MOSI: XT1.CN9_28(PF9) ; port SPI5_3CS.MOSI  [project net DISPLAY.LCD.SPI.MOSI]
STM_SPI5_NSS: XT1.CN10_11(PF6) ; port SPI5_3CS.nCE0  [project net DISPLAY.LCD.SPI.nCE]
STM_SPI5_SCK: XT1.CN9_26(PF7) ; port SPI5_3CS.SCLK  [project net DISPLAY.LCD.SPI.SCLK]
STM_UART9_RX: XT1.CN9_29(PG0) ; port UART9.TX  [project net STM_UART9.TX]
STM_UART9_TX: XT1.CN9_30(PG1) ; port UART9.RX  [project net STM_UART9.RX]

Not connected (* = marked no-connect by the designer): XT1 CN7_5(PB13/RMII_TXD1) CN7_6(VREFP) CN7_9(PA15(JTDI)) CN7_13(PB5/D22) CN7_14(PA7/PB5/RMII_RX_DV) CN7_15(PB3/SWO) CN7_19(PB4(NJTRST)) CN8_1(NC) CN8_3(IOREF) CN8_5(NRST) CN8_6(PC10) CN8_7(3V3) CN8_8(PC11) CN8_10(PC12) CN8_15(VIN) CN9_11(PF10) CN9_13(PB2/COMP1_INP) CN9_14(PE2/SAI_1_A) CN9_15(PE0?) CN9_19(PF1/OSC) CN9_20(PE6/SAI_1_A) CN9_21(PF0/OSC) CN10_1(VDDA) CN10_13(PG6/QSPI_CS) CN10_15(PB2/QSPI_CLK) CN10_25(PE2/QSPI1_IO) CN10_28(PE6/TIM1_BKIN2) CN10_29(PA0/B1) CN10_31(PB0/LD1) CN10_32(PB10/USART1_BL) CN10_34(PB11/USART1_BL)

## Nets that join several sheets
3V3: Power (C11.1 D1.2 D1.4 R5.2), Commutation (P1.2 R6.1 R7.1 XS4.1), Peripherals (F4.1)
C5V: Power (10 pins), Raspberry_Pi4 (XS1.2 XS1.4), Commutation (P1.1), USB (C12.1 C14.2 U1.20 XP3.2), Peripherals (F5.1), STM32-Nucleo-144 (XT1.CN8_9)
GND: Power (23 pins), Raspberry_Pi4 (8 pins), Elvis_PCI (22 pins), Commutation (8 pins), USB (17 pins), Peripherals (25 pins), Inertial_systems (P19.3 P20.8 R29.1), Rangefinders (P22.4 P23.4 XS5.2), Display (P24.2), STM32-Nucleo-144 (10 pins)
P3V3: Peripherals (5 pins), Inertial_systems (R28.2), Display (P24.8 R31.2 R32.2 R33.2)
P5V: Commutation (XS4.2), Peripherals (7 pins), Inertial_systems (P19.1 P20.2), Rangefinders (P22.1 P23.1 XS5.3), Display (P24.1)
9DOF.GYR.INT: Commutation (XS3.9), STM32-Nucleo-144 (XT1.CN7_17)
9DOF.GYR.RDY: Commutation (XS3.10), STM32-Nucleo-144 (XT1.CN9_7)
9DOF.I2C.SCL: Raspberry_Pi4 (XS1.5), Commutation (R6.2), STM32-Nucleo-144 (XT1.CN7_2)
9DOF.I2C.SDA: Raspberry_Pi4 (XS1.3), Commutation (R7.2), STM32-Nucleo-144 (XT1.CN7_4)
9DOF.LSM.DRDY: Commutation (XS3.14), STM32-Nucleo-144 (XT1.CN7_10)
9DOF.LSM.INT1: Commutation (XS3.11), STM32-Nucleo-144 (XT1.CN7_12)
9DOF.LSM.INT2: Commutation (XS3.12), STM32-Nucleo-144 (XT1.CN9_1)
ADC.ALRT: Commutation (XS4.6), STM32-Nucleo-144 (XT1.CN9_3)
BTN0: Raspberry_Pi4 (XS1.15), Peripherals (C22.2 R22.1 SW2.1 SW2.3), STM32-Nucleo-144 (XT1.CN9_17)
BTN1: Raspberry_Pi4 (XS1.16), Peripherals (C24.2 R24.1 SW3.1 SW3.3), STM32-Nucleo-144 (XT1.CN7_20)
COLORSENSOR.INT: Commutation (XS4.5), STM32-Nucleo-144 (XT1.CN10_33)
COLORSENSOR.LED: Commutation (XS4.7), STM32-Nucleo-144 (XT1.CN9_22)
DISPLAY.LCD.DC/RS: Commutation (XS4.33), STM32-Nucleo-144 (XT1.CN8_2)
DISPLAY.LCD.RESET: Commutation (XS4.34), STM32-Nucleo-144 (XT1.CN8_4)
DISPLAY.LCD.SPI.MISO: Commutation (R30.2), STM32-Nucleo-144 (XT1.CN9_24)
DISPLAY.TOUCH.IRQ: Commutation (XS4.40), STM32-Nucleo-144 (XT1.CN9_25)
ENCODER.CLK: Commutation (XS4.12), STM32-Nucleo-144 (XT1.CN10_12)
ENCODER.DT: Commutation (XS4.11), STM32-Nucleo-144 (XT1.CN8_16)
ENCODER.SW: Commutation (XS4.10), STM32-Nucleo-144 (XT1.CN10_2)
GYROSCOPE.CS: Commutation (XS3.7), STM32-Nucleo-144 (XT1.CN9_16)
GYROSCOPE.DR: Commutation (XS3.6), STM32-Nucleo-144 (XT1.CN10_20)
GYROSCOPE.INT: Commutation (XS3.5), STM32-Nucleo-144 (XT1.CN9_18)
GYROSCOPE.SDO: Commutation (XS3.8), STM32-Nucleo-144 (XT1.CN10_18)
KEYPAD.Col0: Commutation (XS4.16), STM32-Nucleo-144 (XT1.CN9_27)
KEYPAD.Col1: Commutation (XS4.13), STM32-Nucleo-144 (XT1.CN8_12)
KEYPAD.Col2: Commutation (XS4.18), STM32-Nucleo-144 (XT1.CN9_8)
KEYPAD.Row0: Commutation (XS4.15), STM32-Nucleo-144 (XT1.CN9_6)
KEYPAD.Row1: Commutation (XS4.20), STM32-Nucleo-144 (XT1.CN9_4)
KEYPAD.Row2: Commutation (XS4.19), STM32-Nucleo-144 (XT1.CN9_2)
KEYPAD.Row3: Commutation (XS4.17), STM32-Nucleo-144 (XT1.CN10_23)
LED0: Raspberry_Pi4 (XS1.18), Peripherals (R19.2), STM32-Nucleo-144 (XT1.CN10_4)
LED1: Raspberry_Pi4 (XS1.19), Peripherals (R20.2), STM32-Nucleo-144 (XT1.CN10_6)
LED2: Raspberry_Pi4 (XS1.21), Peripherals (R21.2), STM32-Nucleo-144 (XT1.CN10_10)
MICROPHONE_DS: Commutation (XS4.8), Peripherals (P18.1), STM32-Nucleo-144 (XT1.CN7_3)
NetR35_1: Peripherals (R35.1), Rangefinders (XS5.1)
RFID.IRQ: Commutation (XS4.25), STM32-Nucleo-144 (XT1.CN7_1)
RFID.RST: Commutation (XS4.26), STM32-Nucleo-144 (XT1.CN7_11)
RPi_GPIO14: Raspberry_Pi4 (XS1.8), USB (U1.5), STM32-Nucleo-144 (XT1.CN10_14)
RPi_GPIO15: Raspberry_Pi4 (XS1.10), USB (U1.1), STM32-Nucleo-144 (XT1.CN10_16)
STEPMOTOR.IN1: Commutation (XS3.4), STM32-Nucleo-144 (XT1.CN10_24)
STEPMOTOR.IN2: Commutation (XS3.3), STM32-Nucleo-144 (XT1.CN10_26)
STEPMOTOR.IN3: Commutation (XS3.2), STM32-Nucleo-144 (XT1.CN10_8)
STEPMOTOR.IN4: Commutation (XS3.1), STM32-Nucleo-144 (XT1.CN10_30)
STM_PD12: Commutation (XS4.23), STM32-Nucleo-144 (XT1.CN10_21)
STM_PD13: Commutation (XS4.22), STM32-Nucleo-144 (XT1.CN10_19)
STM_PD14: Commutation (XS4.24), STM32-Nucleo-144 (XT1.CN7_16)
STM_PD15: Commutation (XS4.21), STM32-Nucleo-144 (XT1.CN7_18)